# EAGLE design digitizerV2 (EAGLE 5.11)

## Sheet 1 of 4
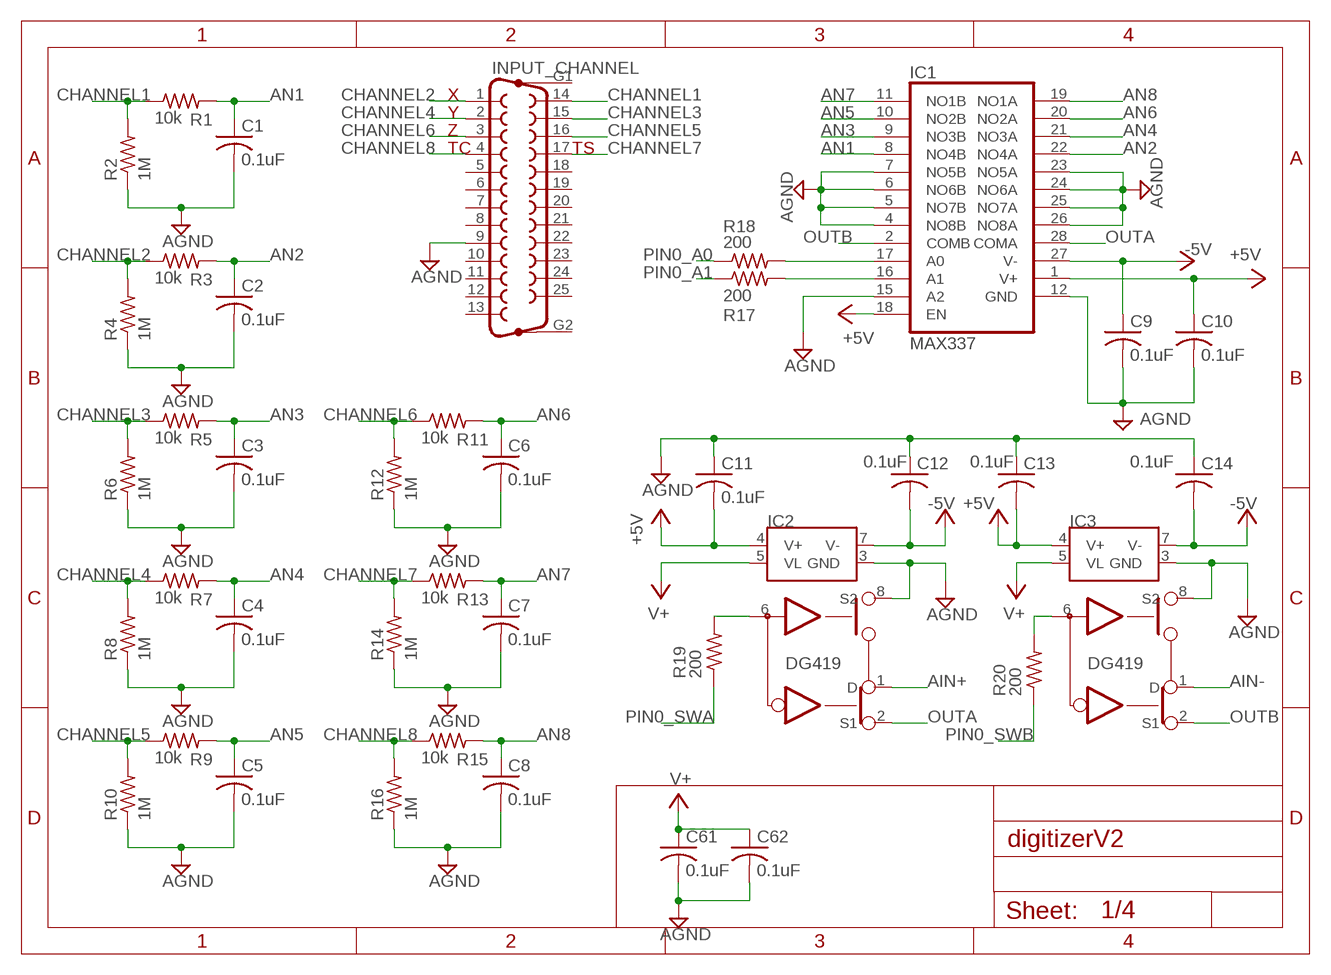
[diagram p0: schematic, sheet 1]

### Parts
C1  0.1uF  C-USC0603  [C0603]
C2  0.1uF  C-USC0603  [C0603]
C3  0.1uF  C-USC0603  [C0603]
C4  0.1uF  C-USC0603  [C0603]
C5  0.1uF  C-USC0603  [C0603]
C6  0.1uF  C-USC0603  [C0603]
C7  0.1uF  C-USC0603  [C0603]
C8  0.1uF  C-USC0603  [C0603]
C9  0.1uF  C-USC0603  [C0603]
C10  0.1uF  C-USC0603  [C0603]
C11  0.1uF  C-USC0603  [C0603]
C12  0.1uF  C-USC0603  [C0603]
C13  0.1uF  C-USC0603  [C0603]
C14  0.1uF  C-USC0603  [C0603]
C61  0.1uF  C-USC0603  [C0603]
C62  0.1uF  C-USC0603  [C0603]
IC1  MAX337  [SSOP28]
IC2  DG419  [SO08]
IC3  DG419  [SO08]
INPUT_CHANNEL  F25HP  [F25HP]
R1  10k  R-US_R0603  [R0603]
R2  1M  R-US_R0603  [R0603]
R3  10k  R-US_R0603  [R0603]
R4  1M  R-US_R0603  [R0603]
R5  10k  R-US_R0603  [R0603]
R6  1M  R-US_R0603  [R0603]
R7  10k  R-US_R0603  [R0603]
R8  1M  R-US_R0603  [R0603]
R9  10k  R-US_R0603  [R0603]
R10  1M  R-US_R0603  [R0603]
R11  10k  R-US_R0603  [R0603]
R12  1M  R-US_R0603  [R0603]
R13  10k  R-US_R0603  [R0603]
R14  1M  R-US_R0603  [R0603]
R15  10k  R-US_R0603  [R0603]
R16  1M  R-US_R0603  [R0603]
R17  200  R-US_R0603  [R0603]
R18  200  R-US_R0603  [R0603]
R19  200  R-US_R0603  [R0603]
R20  200  R-US_R0603  [R0603]

### Nets
+5V: C10.1 C11.2 C13.2 IC1.1(V+) IC1.18(EN) IC2.4(V+) IC3.4(V+) ; also sheet 2,3
-5V: C9.1 C12.2 C14.2 IC1.27(V-) IC2.7(V-) IC3.7(V-) ; also sheet 3
AGND: C1.2 C2.2 C3.2 C4.2 C5.2 C6.2 C7.2 C8.2 C9.2 C10.2 C11.1 C12.1 C13.1 C14.1 C61.2 C62.2 IC1.4(NO8B) IC1.5(NO7B) IC1.6(NO6B) IC1.7(NO5B) IC1.12(GND) IC1.15(A2) IC1.23(NO5A) IC1.24(NO6A) IC1.25(NO7A) IC1.26(NO8A) IC2.3(GND) IC2.8(S2) IC3.3(GND) IC3.8(S2) INPUT_CHANNEL.9 R2.1 R4.1 R6.1 R8.1 R10.1 R12.1 R14.1 R16.1 ; also sheet 2,3,4
AIN+: IC2.1(D) ; also sheet 2
AIN-: IC3.1(D) ; also sheet 2
AN1: C1.1 IC1.8(NO4B) R1.2
AN2: C2.1 IC1.22(NO4A) R3.2
AN3: C3.1 IC1.9(NO3B) R5.2
AN4: C4.1 IC1.21(NO3A) R7.2
AN5: C5.1 IC1.10(NO2B) R9.2
AN6: C6.1 IC1.20(NO2A) R11.2
AN7: C7.1 IC1.11(NO1B) R13.2
AN8: C8.1 IC1.19(NO1A) R15.2
CHANNEL1: INPUT_CHANNEL.14 R1.1 R2.2
CHANNEL2: INPUT_CHANNEL.1 R3.1 R4.2
CHANNEL3: INPUT_CHANNEL.15 R5.1 R6.2
CHANNEL4: INPUT_CHANNEL.2 R7.1 R8.2
CHANNEL5: INPUT_CHANNEL.16 R9.1 R10.2
CHANNEL6: INPUT_CHANNEL.3 R11.1 R12.2
CHANNEL7: INPUT_CHANNEL.17 R13.1 R14.2
CHANNEL8: INPUT_CHANNEL.4 R15.1 R16.2
N$1: IC2.6(IN) R19.2
N$2: IC3.6(IN) R20.2
N$3: IC1.17(A0) R18.2
N$4: IC1.16(A1) R17.2
OUTA: IC1.28(COMA) IC2.2(S1)
OUTB: IC1.2(COMB) IC3.2(S1)
PIN0_A0: R18.1 ; also sheet 4
PIN0_A1: R17.1 ; also sheet 4
PIN0_SWA: R19.1 ; also sheet 4
PIN0_SWB: R20.1 ; also sheet 4
V+: C61.1 C62.1 IC2.5(VL) IC3.5(VL) ; also sheet 2,3,4
Unconnected: INPUT_CHANNEL.5 INPUT_CHANNEL.6 INPUT_CHANNEL.7 INPUT_CHANNEL.8 INPUT_CHANNEL.10 INPUT_CHANNEL.11 INPUT_CHANNEL.12 INPUT_CHANNEL.13 INPUT_CHANNEL.18 INPUT_CHANNEL.19 INPUT_CHANNEL.20 INPUT_CHANNEL.21 INPUT_CHANNEL.22 INPUT_CHANNEL.23 INPUT_CHANNEL.24 INPUT_CHANNEL.25 INPUT_CHANNEL.G1 INPUT_CHANNEL.G2

### Notes on the sheet
- X
- Y
- Z
- TC | TS

## Sheet 2 of 4
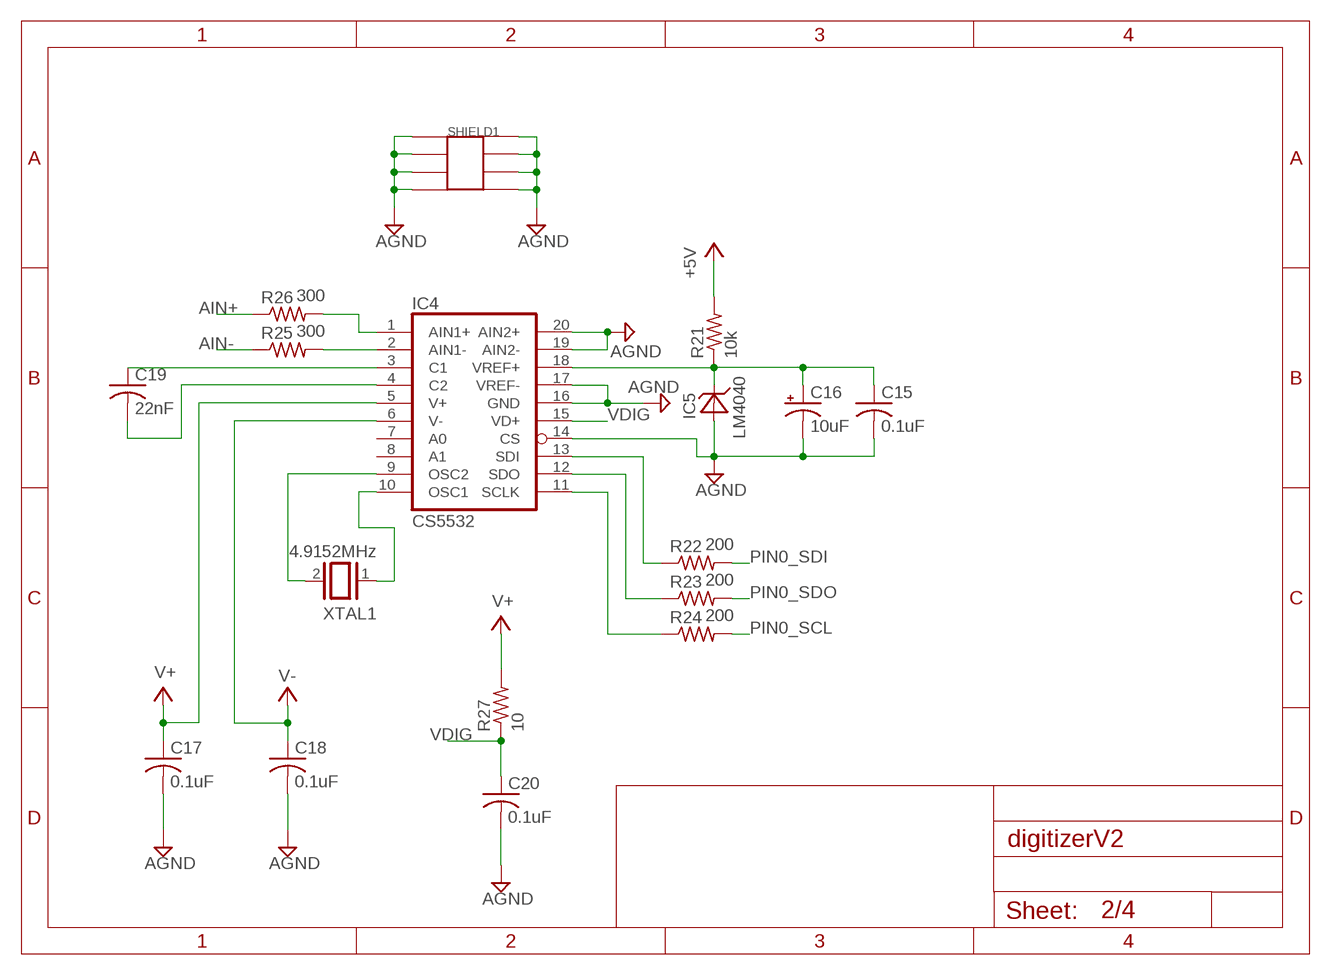
[diagram p1: schematic, sheet 2]

### Parts
C15  0.1uF  C-USC0603  [C0603]
C16  10uF  CPOL-USA/3216-18W  [A/3216-18W]
C17  0.1uF  C-USC0603  [C0603]
C18  0.1uF  C-USC0603  [C0603]
C19  22nF  C-USC0603  [C0603]
C20  0.1uF  C-USC0603  [C0603]
IC4  CS5532  [SSOP20]
IC5  LM4040  LM404  [SOT-23-3]
R21  10k  R-US_R0603  [R0603]
R22  200  R-US_R0603  [R0603]
R23  200  R-US_R0603  [R0603]
R24  200  R-US_R0603  [R0603]
R25  300  R-US_R0603  [R0603]
R26  300  R-US_R0603  [R0603]
R27  10  R-US_R0805  [R0805]
SHIELD1  SHIELD_50X38  [SHIELD_38X50]
XTAL1  4.9152MHz  CRYSTAL_SMD  [CRYSTAL_SMD]

### Nets
+5V: R21.2 ; also sheet 1,3
AGND: C15.2 C16.- C17.2 C18.2 C20.2 IC4.14(CS) IC4.16(GND) IC4.17(VREF-) IC4.19(AIN2-) IC4.20(AIN2+) IC5.2 SHIELD1.P$1 SHIELD1.P$2 SHIELD1.P$3 SHIELD1.P$4 SHIELD1.P$5 SHIELD1.P$6 SHIELD1.P$7 SHIELD1.P$8 ; also sheet 1,3,4
AIN+: R26.1 ; also sheet 1
AIN-: R25.1 ; also sheet 1
N$5: C15.1 C16.+ IC4.18(VREF+) IC5.1 R21.1
N$6: IC4.10(OSC1) XTAL1.1
N$7: IC4.13(SDI) R22.1
N$8: IC4.12(SDO) R23.1
N$9: IC4.11(SCLK) R24.1
N$10: IC4.9(OSC2) XTAL1.2
N$13: C19.1 IC4.3(C1)
N$14: C19.2 IC4.4(C2)
N$15: IC4.2(AIN1-) R25.2
N$16: IC4.1(AIN1+) R26.2
PIN0_SCL: R24.2 ; also sheet 4
PIN0_SDI: R22.2 ; also sheet 4
PIN0_SDO: R23.2 ; also sheet 4
V+: C17.1 IC4.5(V+) R27.2 ; also sheet 1,3,4
V-: C18.1 IC4.6(V-) ; also sheet 3
VDIG: C20.1 IC4.15(VD+) R27.1
Unconnected: IC4.7(A0) IC4.8(A1)

## Sheet 3 of 4
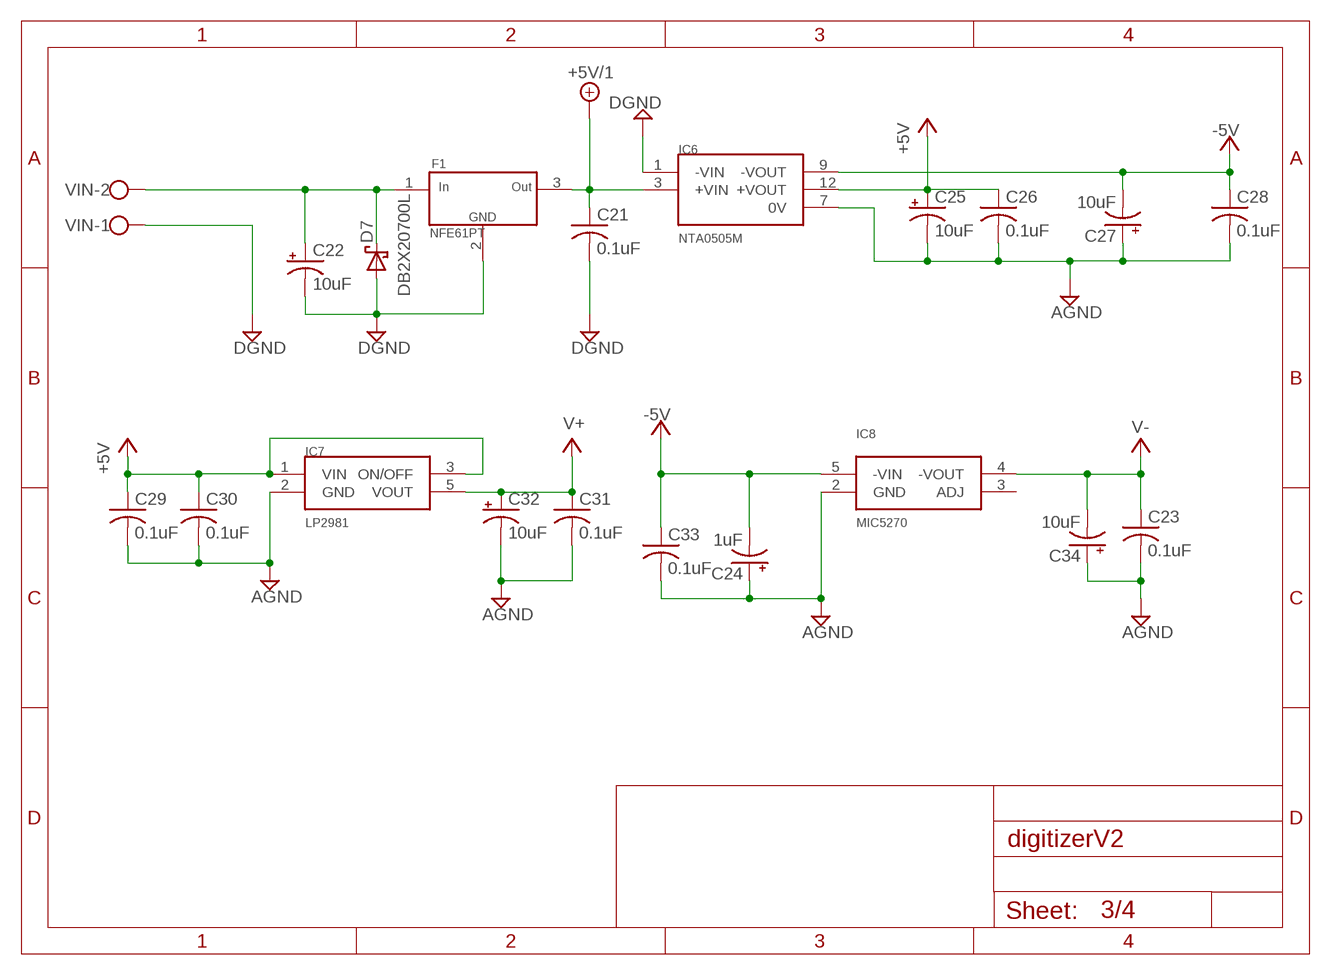
[diagram p2: schematic, sheet 3]

### Parts
C21  0.1uF  C-USC0603  [C0603]
C22  10uF  CPOL-USA/3216-18W  [A/3216-18W]
C23  0.1uF  C-USC0603  [C0603]
C24  1uF  CPOL-USB  [PANASONIC_B]
C25  10uF  CPOL-USA/3216-18W  [A/3216-18W]
C26  0.1uF  C-USC0603  [C0603]
C27  10uF  CPOL-USA/3216-18W  [A/3216-18W]
C28  0.1uF  C-USC0603  [C0603]
C29  0.1uF  C-USC0603  [C0603]
C30  0.1uF  C-USC0603  [C0603]
C31  0.1uF  C-USC0603  [C0603]
C32  10uF  CPOL-USA/3216-18W  [A/3216-18W]
C33  0.1uF  C-USC0603  [C0603]
C34  10uF  CPOL-USA/3216-18W  [A/3216-18W]
D7  DB2X20700L  SCHOTTKY_SMD  [DIODE_PW]
F1  NFE61PT  EMIFIL  [NFE-2706]
IC6  NTA0505M  [DCDC]
IC7  LP2981  [SOT-23-5]
IC8  MIC5270  [SOT-23-5]
VIN  W237-102  [W237-102]

### Nets
+5V: C25.+ C26.1 C29.1 C30.1 IC6.12(+VOUT) IC7.1(VIN) IC7.3(ON/OFF) ; also sheet 1,2
+5V/1: C21.1 F1.3 IC6.3(+VIN) ; also sheet 4
-5V: C24.- C27.- C28.1 C33.1 IC6.9(-VOUT) IC8.5(-VIN) ; also sheet 1
AGND: C23.2 C24.+ C25.- C26.2 C27.+ C28.2 C29.2 C30.2 C31.2 C32.- C33.2 C34.+ IC6.7(0V) IC7.2(GND) IC8.2(GND) ; also sheet 1,2,4
DGND: C21.2 C22.- D7.A F1.2 IC6.1(-VIN) VIN.1 ; also sheet 4
N$52: C22.+ D7.K(C) F1.1 VIN.2
V+: C31.1 C32.+ IC7.5(VOUT) ; also sheet 1,2,4
V-: C23.1 C34.- IC8.4(-VOUT) ; also sheet 2
Unconnected: IC8.3(ADJ)

## Sheet 4 of 4
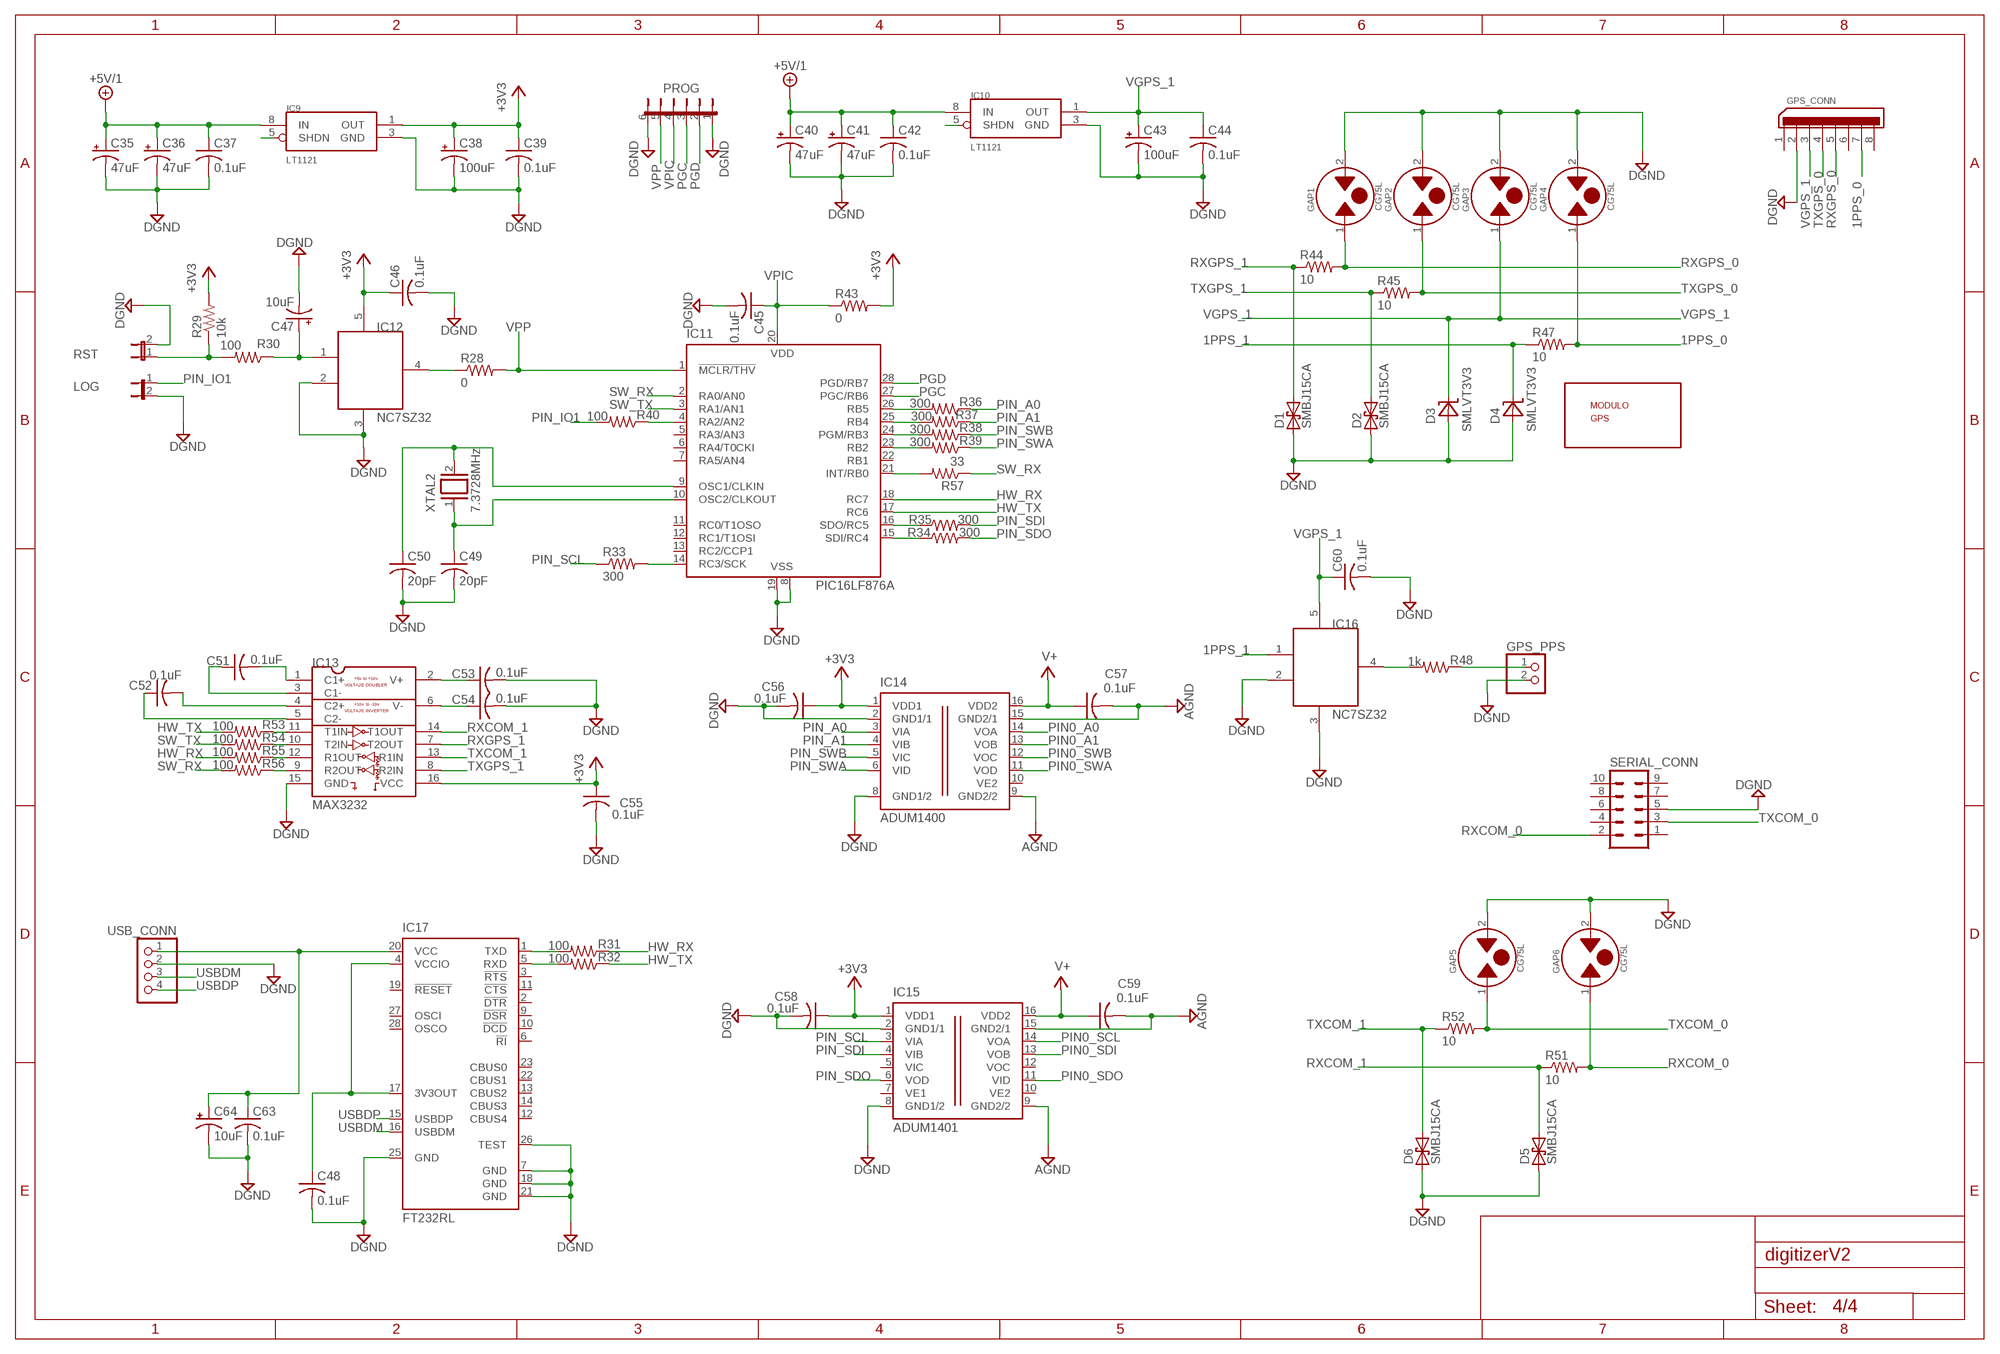
[diagram p3: schematic, sheet 4]

### Parts
C35  47uF  CPOL-USE  [PANASONIC_E]
C36  47uF  CPOL-USE  [PANASONIC_E]
C37  0.1uF  C-USC0603  [C0603]
C38  100uF  CPOL-USE  [PANASONIC_E]
C39  0.1uF  C-USC0603  [C0603]
C40  47uF  CPOL-USE  [PANASONIC_E]
C41  47uF  CPOL-USE  [PANASONIC_E]
C42  0.1uF  C-USC0603  [C0603]
C43  100uF  CPOL-USE  [PANASONIC_E]
C44  0.1uF  C-USC0603  [C0603]
C45  0.1uF  C-USC0603  [C0603]
C46  0.1uF  C-USC0603  [C0603]
C47  10uF  CPOL-USA/3216-18W  [A/3216-18W]
C48  0.1uF  C-USC0603  [C0603]
C49  20pF  C-USC0603  [C0603]
C50  20pF  C-USC0603  [C0603]
C51  0.1uF  C-USC0603  [C0603]
C52  0.1uF  C-USC0603  [C0603]
C53  0.1uF  C-USC0603  [C0603]
C54  0.1uF  C-USC0603  [C0603]
C55  0.1uF  C-USC0603  [C0603]
C56  0.1uF  C-USC0603  [C0603]
C57  0.1uF  C-USC0603  [C0603]
C58  0.1uF  C-USC0603  [C0603]
C59  0.1uF  C-USC0603  [C0603]
C60  0.1uF  C-USC0603  [C0603]
C63  0.1uF  C-USC0603  [C0603]
C64  10uF  CPOL-USA/3216-18W  [A/3216-18W]
D1  SMBJ15CA  MSBJ15CA  [DIODE_KK2]
D2  SMBJ15CA  MSBJ15CA  [DIODE_KK2]
D3  SMLVT3V3  SMBJ5.0A  [DIODE_KK]
D4  SMLVT3V3  SMBJ5.0A  [DIODE_KK]
D5  SMBJ15CA  MSBJ15CA  [DIODE_KK2]
D6  SMBJ15CA  MSBJ15CA  [DIODE_KK2]
GAP1  CG75L  [GAP]
GAP2  CG75L  [GAP]
GAP3  CG75L  [GAP]
GAP4  CG75L  [GAP]
GAP5  CG75L  [GAP]
GAP6  CG75L  [GAP]
GPS_CONN  MOLEX_FLEX8  [MOLEX_FLEX8PIN]
GPS_PPS  PINHD-1X2  [1X02]
IC9  LT1121  LT1121-3.3  [SO08]
IC10  LT1121  LT1121-3.3  [SO08]
IC11  PIC16LF876A  PIC16F876SO  [SO28W]
IC12  NC7SZ32  NC7S32  [SOT-23-5]
IC13  MAX3232  [SOIC16N]
IC14  ADUM1400  [SO-16W]
IC15  ADUM1401  [SO-16W]
IC16  NC7SZ32  NC7S32  [SOT-23-5]
IC17  FT232RL  [SSOP28]
LOG  HEADER_SMD_2  [HEADER_SMD_2]
MODGPS1  GPS15LF  [GPS15LF]
PROG  HEADER_SMD_6  [HEADER_SMD_6]
R28  0  R-US_R0603  [R0603]
R29  10k  R-US_R0603  [R0603]
R30  100  R-US_R0603  [R0603]
R31  100  R-US_R0603  [R0603]
R32  100  R-US_R0603  [R0603]
R33  300  R-US_R0603  [R0603]
R34  300  R-US_R0603  [R0603]
R35  300  R-US_R0603  [R0603]
R36  300  R-US_R0603  [R0603]
R37  300  R-US_R0603  [R0603]
R38  300  R-US_R0603  [R0603]
R39  300  R-US_R0603  [R0603]
R40  100  R-US_R0603  [R0603]
R43  0  R-US_R0603  [R0603]
R44  10  R-US_R0805  [R0805]
R45  10  R-US_R0805  [R0805]
R47  10  R-US_R0805  [R0805]
R48  1k  R-US_R0603  [R0603]
R51  10  R-US_R0805  [R0805]
R52  10  R-US_R0805  [R0805]
R53  100  R-US_R0603  [R0603]
R54  100  R-US_R0603  [R0603]
R55  100  R-US_R0603  [R0603]
R56  100  R-US_R0603  [R0603]
R57  33  R-US_R0603  [R0603]
RST  HEADER_SMD_2  [HEADER_SMD_2]
SERIAL_CONN  ML10  [ML10]
USB_CONN  PINHD-1X4  [1X04]
XTAL2  7.3728MHz  CRYSTAL_SMD  [CRYSTAL_SMD]

### Nets
1PPS_0: GAP4.1 GPS_CONN.7 R47.2
1PPS_1: D4.A1(C) IC16.1(IN1) R47.1
+3V3: C38.+ C39.1 C46.1 C55.1 C56.1 C58.1 IC9.1(OUT) IC12.5(1_VCC) IC13.16(VCC) IC14.1(VDD1) IC15.1(VDD1) R29.2 R43.2
+5V/1: C35.+ C36.+ C37.1 C40.+ C41.+ C42.1 IC9.8(IN) IC10.8(IN) ; also sheet 3
AGND: C57.2 C59.2 IC14.9(GND2/2) IC14.15(GND2/1) IC15.9(GND2/2) IC15.15(GND2/1) ; also sheet 1,2,3
DGND: C35.- C36.- C37.2 C38.- C39.2 C40.- C41.- C42.2 C43.- C44.2 C45.2 C46.2 C47.- C48.2 C49.2 C50.2 C53.2 C54.2 C55.2 C56.2 C58.2 C60.2 C63.2 C64.- D1.A1 D2.A1 D3.A2(A) D4.A2(A) D5.A1 D6.A1 GAP1.2 GAP2.2 GAP3.2 GAP4.2 GAP5.2 GAP6.2 GPS_CONN.2 GPS_PPS.2 IC9.3(GND) IC10.3(GND) IC11.8(VSS) IC11.19(VSS) IC12.2(IN2) IC12.3(1_GND) IC13.15(GND) IC14.2(GND1/1) IC14.8(GND1/2) IC15.2(GND1/1) IC15.8(GND1/2) IC16.2(IN2) IC16.3(1_GND) IC17.7(GND) IC17.18(GND) IC17.21(GND) IC17.25(GND) IC17.26(TEST) LOG.2 PROG.1 PROG.6 RST.2 SERIAL_CONN.5 USB_CONN.2 ; also sheet 3
HW_RX: IC11.18(RC7) R31.1 R55.2
HW_TX: IC11.17(RC6) R32.1 R53.2
N$11: C52.2 IC13.4(C2+)
N$12: R29.1 R30.2 RST.1
N$17: IC12.4(OUT) R28.1
N$19: C49.1 IC11.10(OSC2/CLKOUT) XTAL2.1
N$20: C47.+ IC12.1(IN1) R30.1
N$21: C48.1 IC17.4(VCCIO) IC17.17(3V3OUT)
N$22: C50.1 IC11.9(OSC1/CLKIN) XTAL2.2
N$23: IC17.1(TXD) R31.2
N$24: IC11.16(SDO/RC5) R35.1
N$25: IC11.15(SDI/RC4) R34.1
N$26: IC11.14(RC3/SCK) R33.2
N$27: IC11.26(RB5) R36.2
N$28: IC11.25(RB4) R37.2
N$29: IC11.24(PGM/RB3) R38.2
N$30: IC11.23(RB2) R39.2
N$31: IC11.4(RA2/AN2) R40.1
N$32: IC17.5(RXD) R32.2
N$33: C63.1 C64.+ IC17.20(VCC) USB_CONN.1
N$34: C51.2 IC13.1(C1+)
N$35: C51.1 IC13.3(C1-)
N$36: C52.1 IC13.5(C2-)
N$37: IC13.11(T1IN) R53.1
N$38: C53.1 IC13.2(V+)
N$39: C54.1 IC13.6(V-)
N$40: IC16.4(OUT) R48.2
N$41: GPS_PPS.1 R48.1
N$42: IC13.10(T2IN) R54.1
N$44: IC13.12(R1OUT) R55.1
N$45: IC13.9(R2OUT) R56.1
N$46: IC11.21(INT/RB0) R57.2
N$47: IC10.5(SHDN)
N$48: IC9.5(SHDN)
PGC: IC11.27(PGC/RB6) PROG.3
PGD: IC11.28(PGD/RB7) PROG.2
PIN0_A0: IC14.14(VOA) ; also sheet 1
PIN0_A1: IC14.13(VOB) ; also sheet 1
PIN0_SCL: IC15.14(VOA) ; also sheet 2
PIN0_SDI: IC15.13(VOB) ; also sheet 2
PIN0_SDO: IC15.11(VID) ; also sheet 2
PIN0_SWA: IC14.11(VOD) ; also sheet 1
PIN0_SWB: IC14.12(VOC) ; also sheet 1
PIN_A0: IC14.3(VIA) R36.1
PIN_A1: IC14.4(VIB) R37.1
PIN_IO1: LOG.1 R40.2
PIN_SCL: IC15.3(VIA) R33.1
PIN_SDI: IC15.4(VIB) R35.2
PIN_SDO: IC15.6(VOD) R34.2
PIN_SWA: IC14.6(VID) R39.1
PIN_SWB: IC14.5(VIC) R38.1
RXCOM_0: GAP6.1 R51.2 SERIAL_CONN.2
RXCOM_1: D5.A2 IC13.14(T1OUT) R51.1
RXGPS_0: GAP1.1 GPS_CONN.5 R44.2
RXGPS_1: D1.A2 IC13.7(T2OUT) R44.1
SW_RX: IC11.2(RA0/AN0) R56.2 R57.1
SW_TX: IC11.3(RA1/AN1) R54.2
TXCOM_0: GAP5.1 R52.2 SERIAL_CONN.3
TXCOM_1: D6.A2 IC13.13(R1IN) R52.1
TXGPS_0: GAP2.1 GPS_CONN.4 R45.2
TXGPS_1: D2.A2 IC13.8(R2IN) R45.1
USBDM: IC17.16(USBDM) USB_CONN.3
USBDP: IC17.15(USBDP) USB_CONN.4
V+: C57.1 C59.1 IC14.16(VDD2) IC15.16(VDD2) ; also sheet 1,2,3
VGPS_1: C43.+ C44.1 C60.1 D3.A1(C) GAP3.1 GPS_CONN.3 IC10.1(OUT) IC16.5(1_VCC)
VPIC: C45.1 IC11.20(VDD) PROG.4 R43.1
VPP: IC11.1(!MCLR/THV) PROG.5 R28.2
Unconnected: GPS_CONN.1 GPS_CONN.6 GPS_CONN.8 IC11.5(RA3/AN3) IC11.6(RA4/T0CKI) IC11.7(RA5/AN4) IC11.11(RC0/T1OSO) IC11.12(RC1/T1OSI) IC11.13(RC2/CCP1) IC11.22(RB1) IC14.10(VE2) IC15.5(VIC) IC15.7(VE1) IC15.10(VE2) IC15.12(VOC) IC17.2(!DTR) IC17.3(!RTS) IC17.6(!RI) IC17.9(!DSR) IC17.10(!DCD) IC17.11(!CTS) IC17.12(CBUS4) IC17.13(CBUS2) IC17.14(CBUS3) IC17.19(!RESET) IC17.22(CBUS1) IC17.23(CBUS0) IC17.27(OSCI) IC17.28(OSCO) SERIAL_CONN.1 SERIAL_CONN.4 SERIAL_CONN.6 SERIAL_CONN.7 SERIAL_CONN.8 SERIAL_CONN.9 SERIAL_CONN.10

## Library data of the parts
C1-C15 C17-C21 C23 C26 C28-C31 C33 C37 C39 C42 C44-C46 C48-C63 = rcl:C-US: CAPACITOR, American symbol
C16 C22 C24 C25 C27 C32 C34-C36 C38 C40 C41 C43 C47 C64 = rcl:CPOL-US: POLARIZED CAPACITOR, American symbol
D1 D2 D5 D6 = magnetometro:MSBJ15CA
D3 D4 = magnetometro:SMBJ5.0A
D7 = magnetometro:SCHOTTKY_SMD
F1 = magnetometro:EMIFIL
GAP1-GAP6 = magnetometro:CG75L
GPS_CONN = magnetometro:MOLEX_FLEX8
GPS_PPS = pinhead:PINHD-1X2: PIN HEADER
IC1 = Ricardo_Library:MAX337
IC2 IC3 = Ricardo_Library:DG419
IC4 = Ricardo_Library:CS5532
IC5 = Ricardo_Library:LM404
IC6 = Ricardo_Library:NTA0505M
IC7 = Ricardo_Library:LP2981
IC8 = Ricardo_Library:MIC5270
IC9 IC10 = Ricardo_Library:LT1121-3.3
IC11 = Ricardo_Library:PIC16F876SO
IC12 IC16 = magnetometro:NC7S32
IC13 = Ricardo_Library:MAX3232
IC14 = Ricardo_Library:ADUM1400
IC15 = Ricardo_Library:ADUM1401
IC17 = ftdichip:FT232R: Source: http://www.ftdichip.com/Documents/DataSheets/DS_FT232R_v104.pdf; MPN: FT232RL; OC_FARNELL: 1146032; OC_NEWARK: 91K9918
INPUT_CHANNEL = con-subd:F25HP: SUB-D; OC_FARNELL: unknown; OC_NEWARK: unknown
LOG RST = Ricardo_Library:HEADER_SMD_2
MODGPS1 = magnetometro:GPS15LF
PROG = Ricardo_Library:HEADER_SMD_6
R1-R40 R43-R45 R47 R48 R51-R57 = rcl:R-US_: RESISTOR, American symbol
SERIAL_CONN = con-harting-ml:ML10: HARTING; OC_FARNELL: unknown; OC_NEWARK: unknown
SHIELD1 = magnetometro:SHIELD_50X38
USB_CONN = pinhead:PINHD-1X4: PIN HEADER
VIN = con-wago-500:W237-102: WAGO SCREW CLAMP; MPN: 237-102; OC_FARNELL: unknown; OC_NEWARK: 70K9898
XTAL1 XTAL2 = Ricardo_Library:CRYSTAL_SMD

## Board
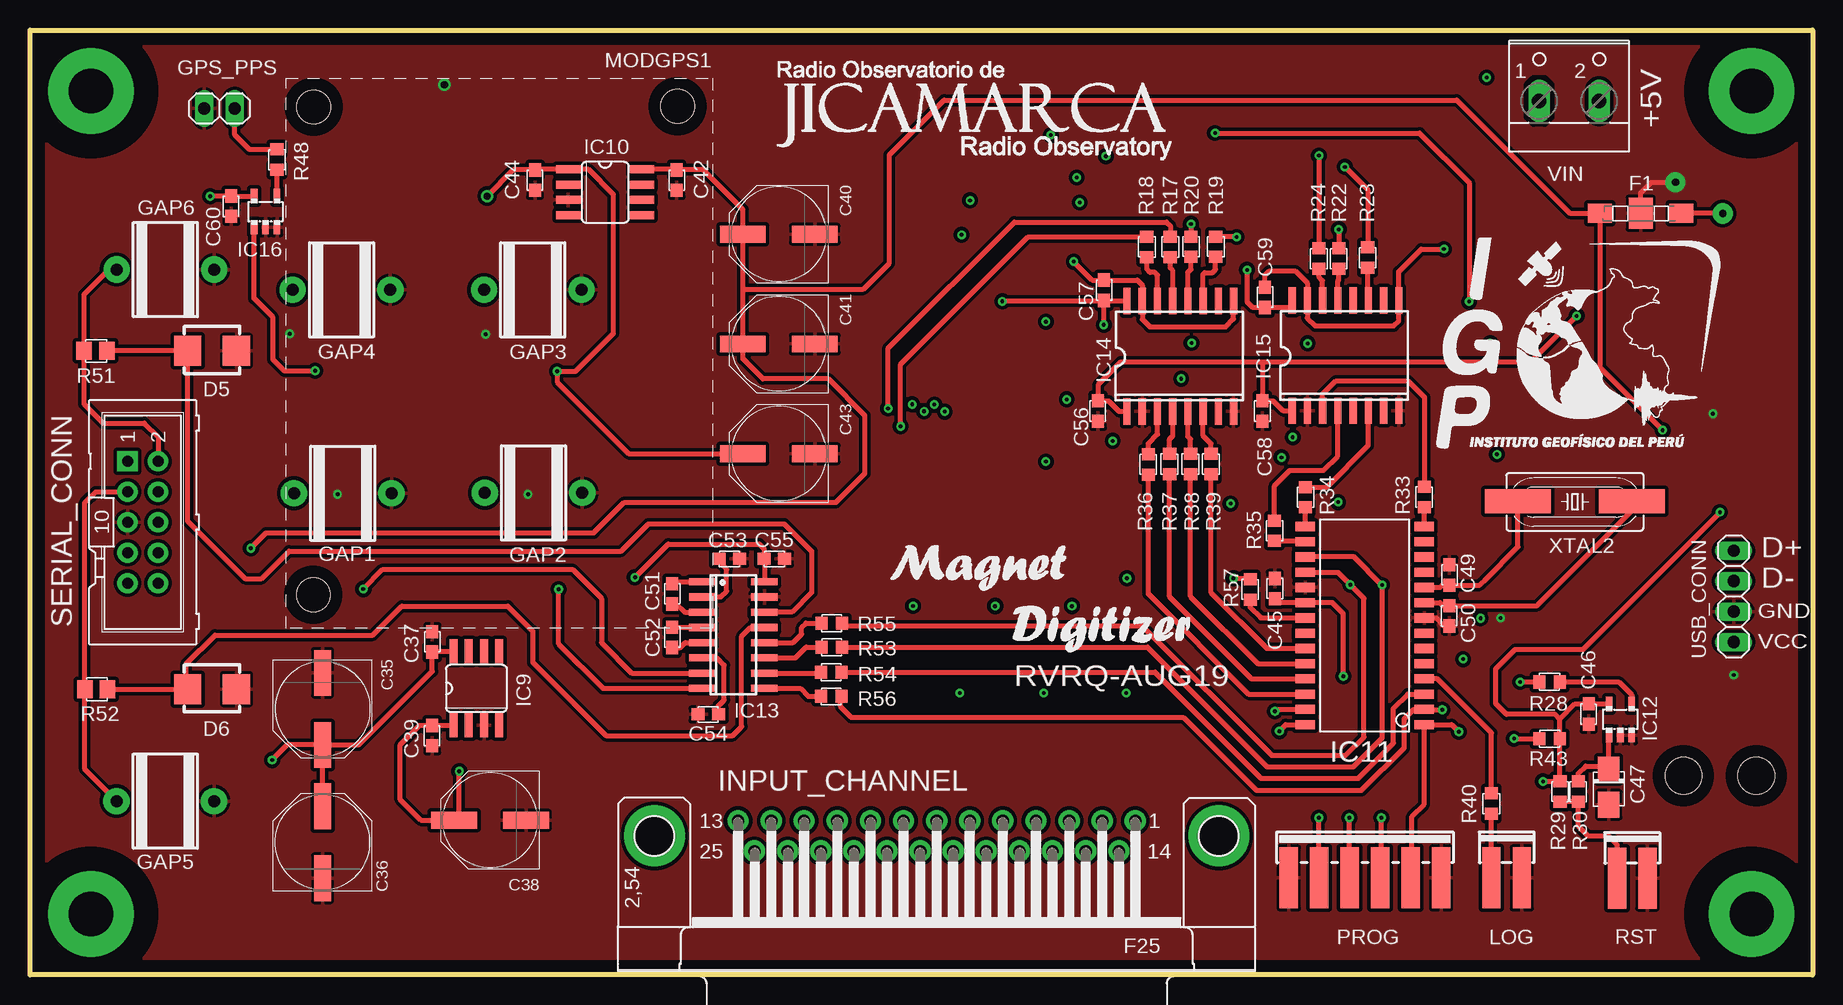
[diagram p4: board, top side]
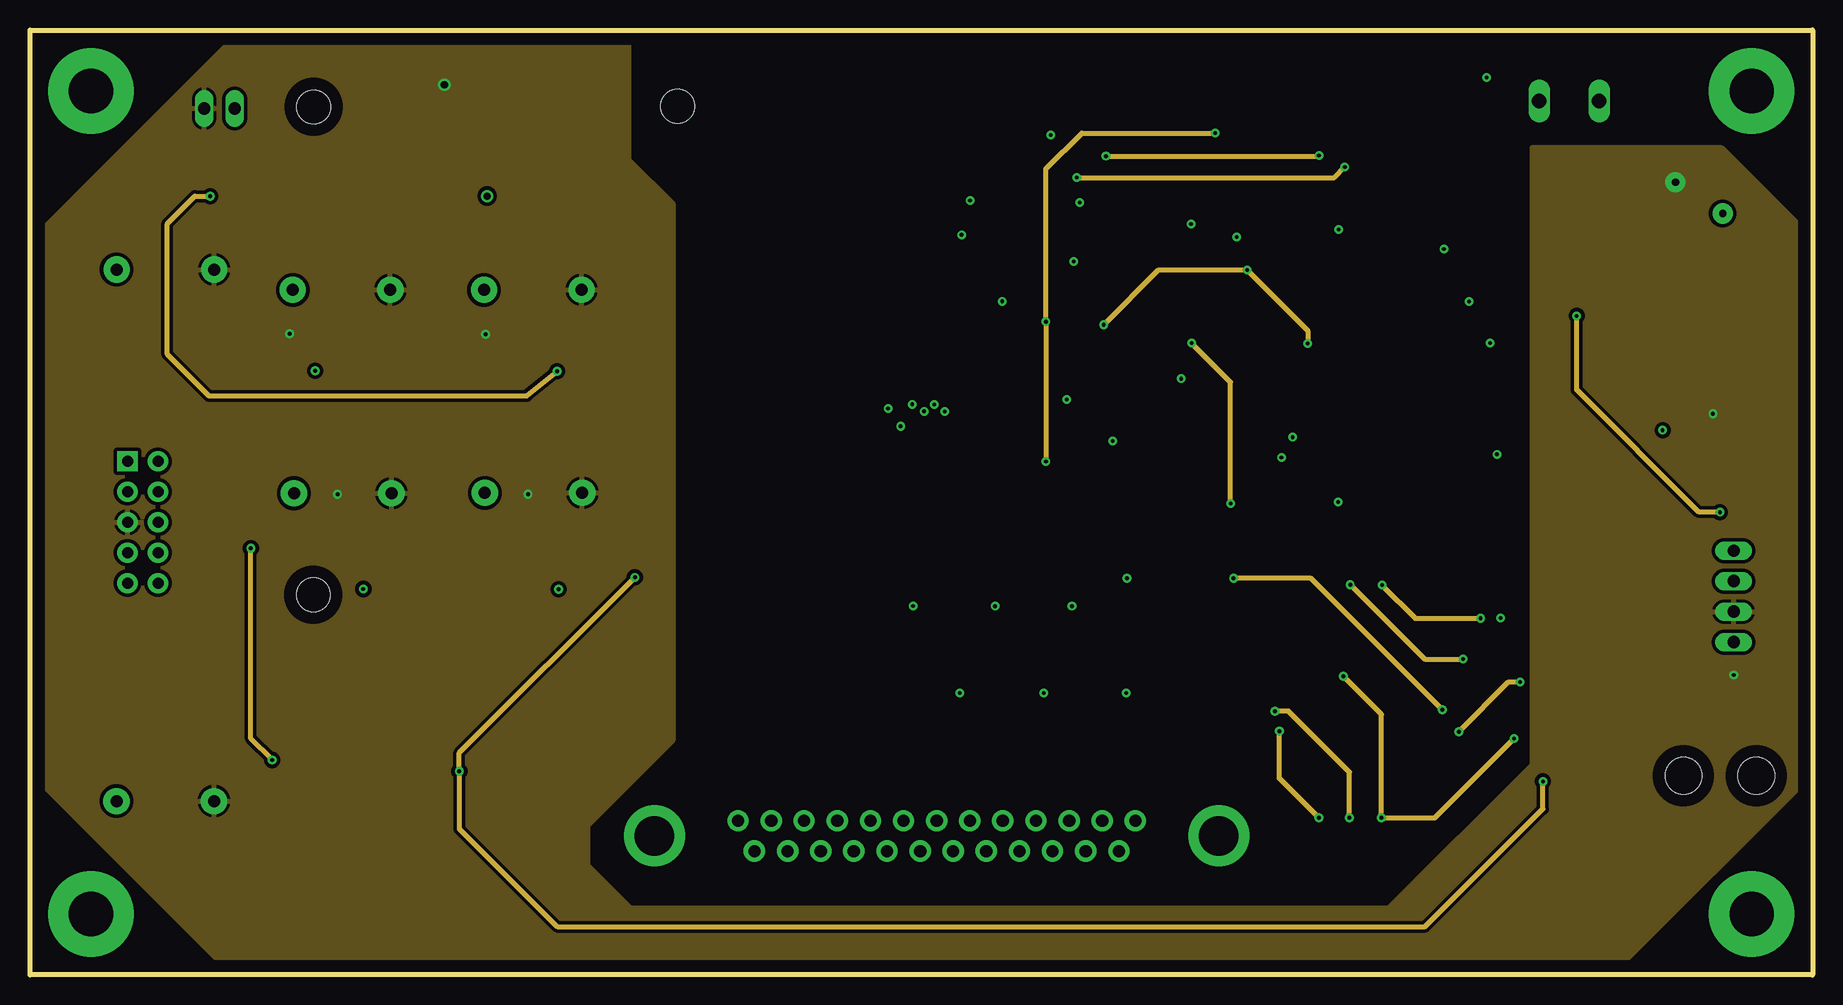
[diagram p5: board, inner layer Route2]
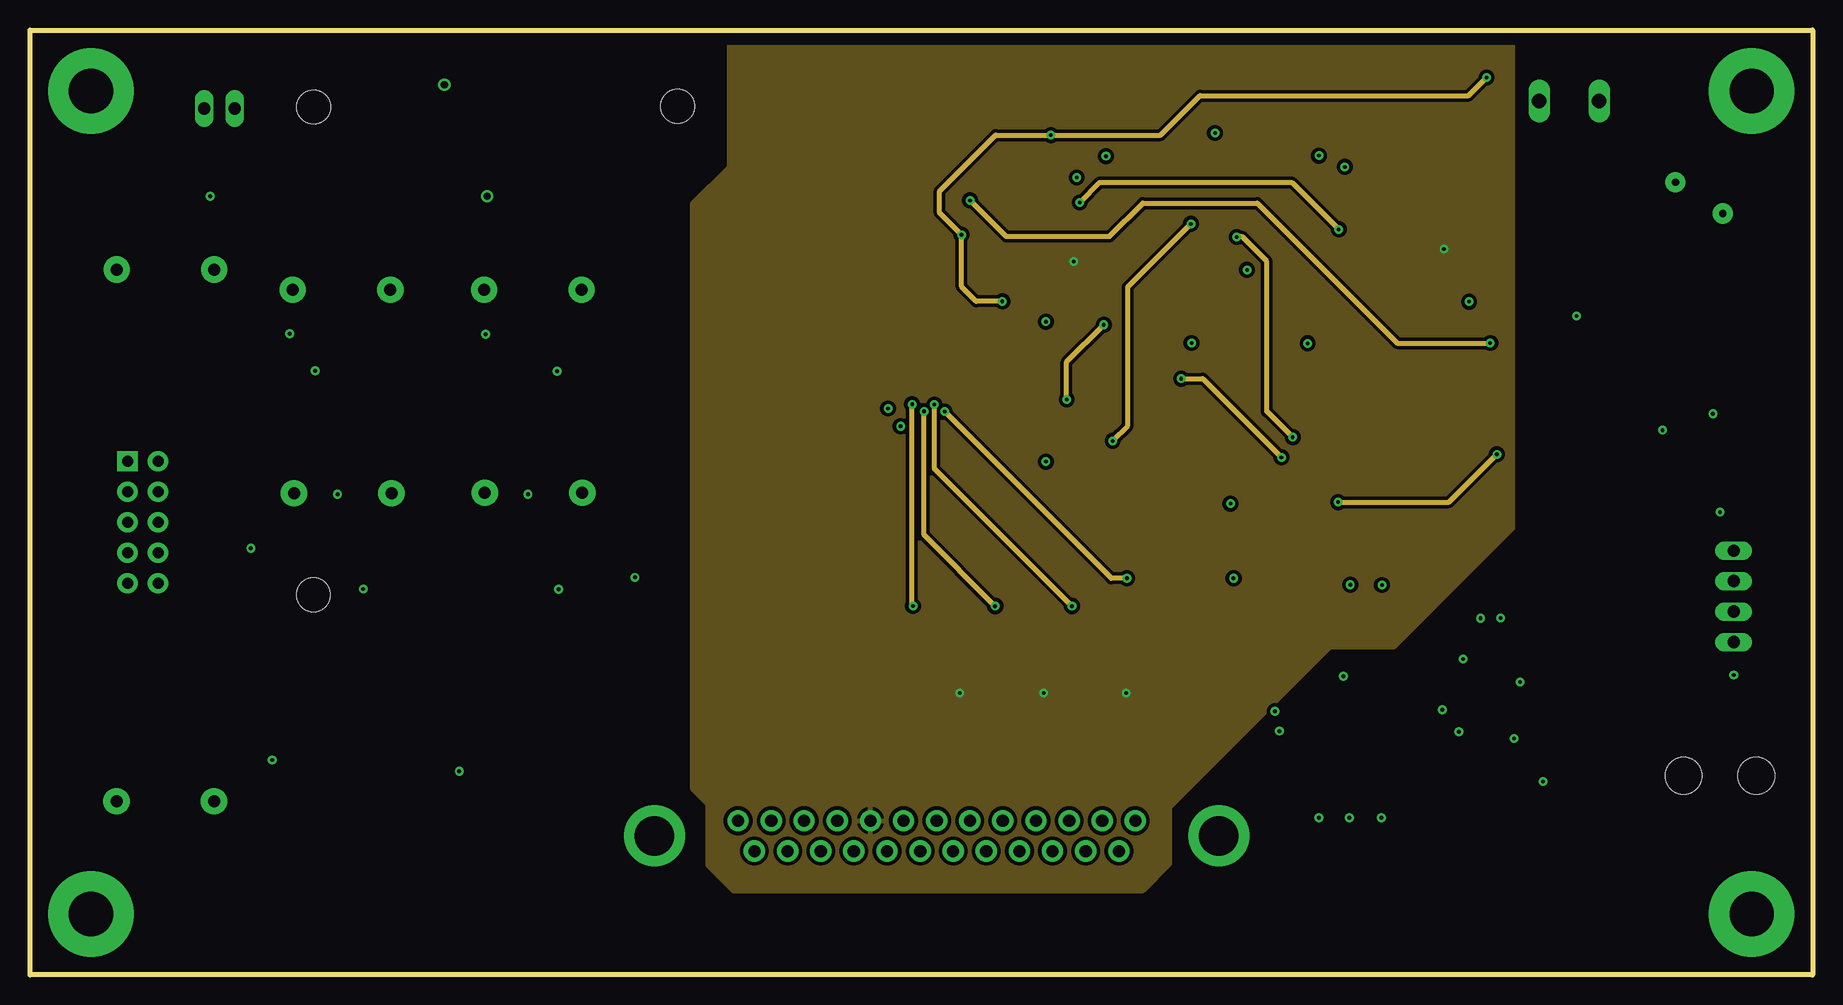
[diagram p6: board, inner layer Route15]
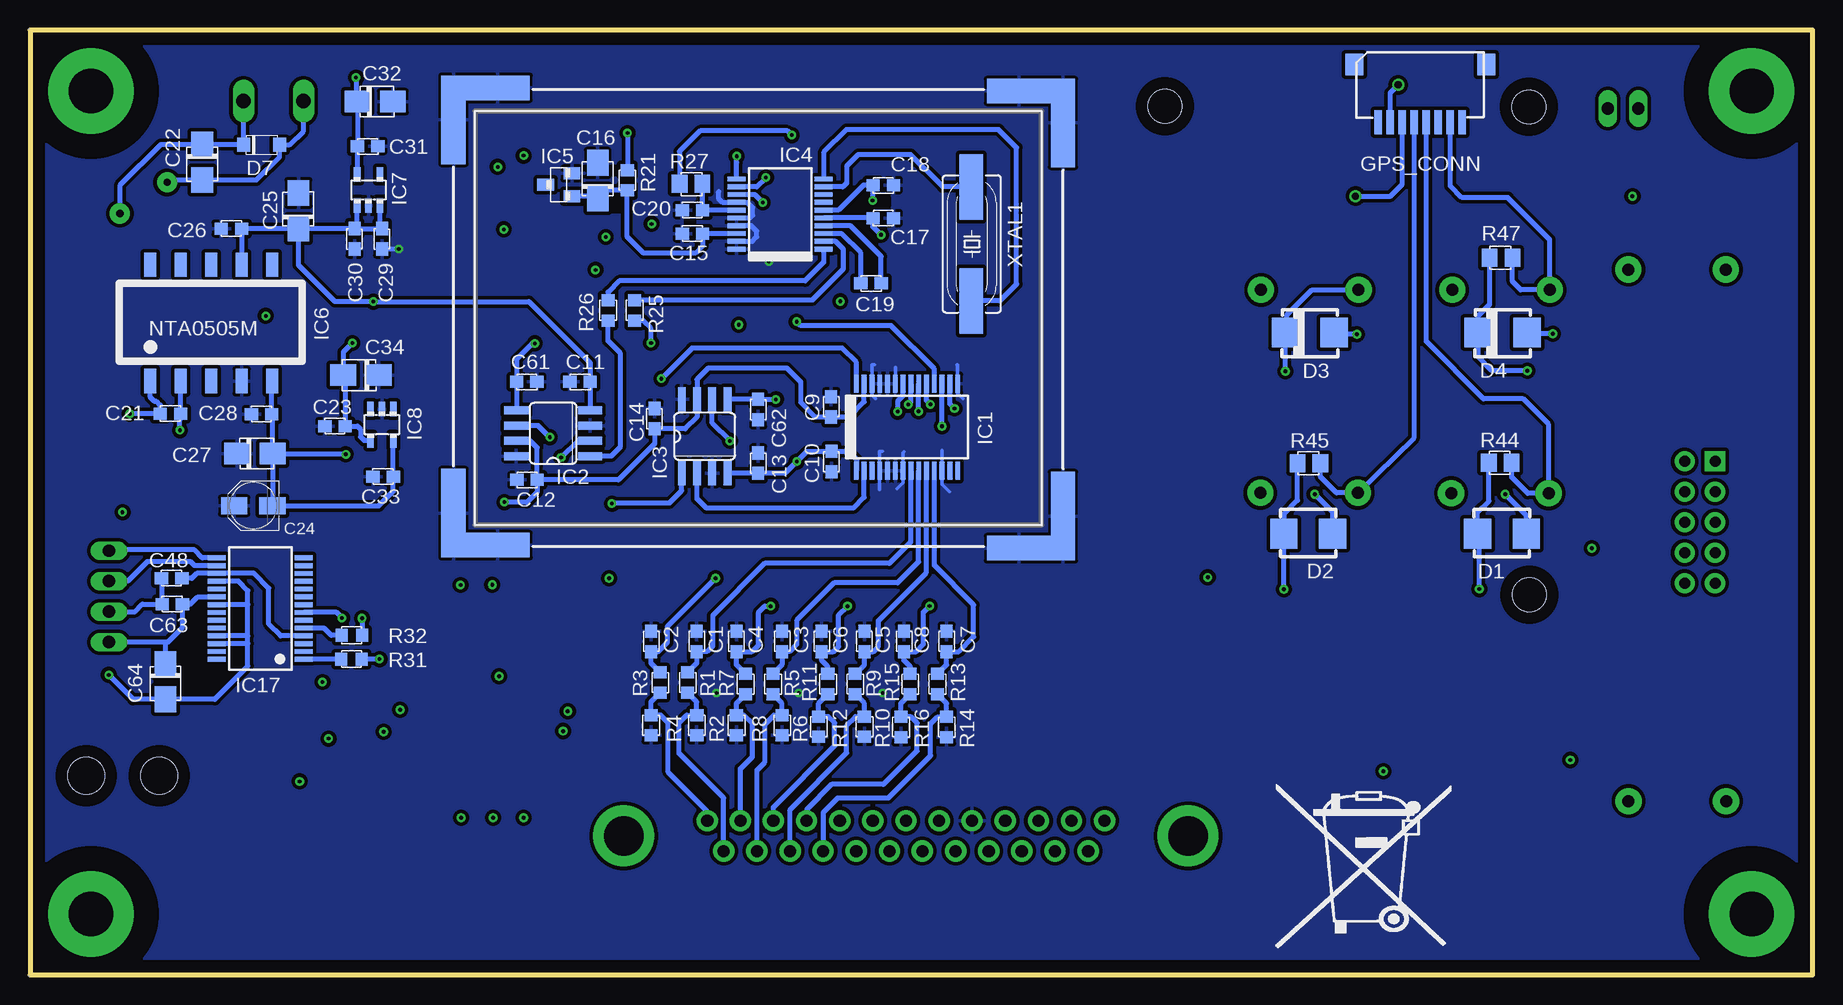
[diagram p7: board, bottom side, seen from below]

Size 148.59 x 78.74 mm. Coordinates in mm from the lower left corner, seen from the top.
Outline: 0,78.74 148.59,78.74 148.59,0 0,0 0,78.74
Copper layers (1+2*15+16): Top 0.035mm / dielectric 1.5mm / Route2 0.035mm / dielectric 0.15mm / Route15 0.035mm / dielectric 0.2mm / Bottom 0.035mm
Design rules "default *": minimum track width 10mil, minimum drill 24mil, track to track 8mil, track to pad 8mil, pad to pad 8mil, via to via 8mil, smd to smd 8mil, copper to edge 40mil, drill to drill 8mil, minimum pad ring 10mil, minimum via ring 8mil, stop-mask expansion 4mil, vias tented up to drill 0mil, thermal gap 10mil
Holes 3.05 mm at 137.83,16.6 143.9,16.6
tRestrict: area 0,68.6 to 10.2,78.8; area 0,0 to 10.2,10.2; area 138.4,0 to 148.6,10.2; area 138.4,68.6 to 148.6,78.8; area 124.8,71 to 126.7,74.7
bRestrict: area -0.1,68.5 to 10.2,78.8; area -0.1,-0.1 to 10.2,10.2; area 138.4,-0.1 to 148.6,10.2; area 138.4,68.5 to 148.6,78.8; 5 lines

### Footprints (pad centres in the part's own frame; a part is rotated, then mirrored left to right if it is on the bottom)
C0603 = smd 1.1 x 1: 1 -0.85,0; 2 0.85,0
A/3216-18W = smd 2.15 x 1.8: + 1.475,0; - -1.475,0
PANASONIC_B = smd 2.2 x 1.4: + 1.6,0; - -1.6,0
PANASONIC_E = smd 3.8 x 1.4: + 3,0; - -3,0
DIODE_KK2 = smd 2.286 x 2.489: A1 -2.286,-0.508; A2 1.778,-0.508
DIODE_KK = smd 2.286 x 2.489: A1 0.254,2.032; A2 4.318,2.032
DIODE_PW = smd 1.1 x 1.1: A 0,-1.5; K 0,1.5
NFE-2706 = smd 2 x 1.6: 1 -3.4,0; 3 3.4,0 | smd 2 x 2.6: 2 0,0
GAP = drill 1 pad 2.184 round: 1 -4.064,0; 2 4.064,0
MOLEX_FLEX8PIN = smd 0.6 x 2: 1 -3.19,-2.54; 2 -2.19,-2.54; 3 -1.19,-2.54; 4 -0.19,-2.54; 5 0.81,-2.54; 6 1.81,-2.54; 7 2.81,-2.54; 8 3.81,-2.54 | smd 1.5 x 1.8: NC1 -5.19,2.26; NC2 5.835,2.258
1X02 = drill 1.016 long: 1 -1.27,0; 2 1.27,0
SSOP28 = smd 0.4 x 1.5: 1 -4.225,-3.625; 2 -3.575,-3.625; 3 -2.925,-3.625; 4 -2.275,-3.625; 5 -1.625,-3.625; 6 -0.975,-3.625; 7 -0.325,-3.625; 8 0.325,-3.625; 9 0.975,-3.625; 10 1.625,-3.625; 11 2.275,-3.625; 12 2.925,-3.625; 13 3.575,-3.625; 14 4.225,-3.625; 15 4.225,3.625; 16 3.575,3.625; 17 2.925,3.625; 18 2.275,3.625; 19 1.625,3.625; 20 0.975,3.625; 21 0.325,3.625; 22 -0.325,3.625; 23 -0.975,3.625; 24 -1.625,3.625; 25 -2.275,3.625; 26 -2.925,3.625; 27 -3.575,3.625; 28 -4.225,3.625
SO08 = smd 0.66 x 2.032: 1 -1.905,-3.073; 2 -0.635,-3.073; 3 0.635,-3.073; 4 1.905,-3.073; 5 1.905,3.073; 6 0.635,3.073; 7 -0.635,3.073; 8 -1.905,3.073
SSOP20 = smd 0.4 x 1.5: 1 -2.925,-3.625; 2 -2.275,-3.625; 3 -1.625,-3.625; 4 -0.975,-3.625; 5 -0.325,-3.625; 6 0.325,-3.625; 7 0.975,-3.625; 8 1.625,-3.625; 9 2.275,-3.625; 10 2.925,-3.625; 11 2.925,3.625; 12 2.275,3.625; 13 1.625,3.625; 14 0.975,3.625; 15 0.325,3.625; 16 -0.325,3.625; 17 -0.975,3.625; 18 -1.625,3.625; 19 -2.275,3.625; 20 -2.925,3.625
SOT-23-3 = smd 1 x 1.4: 1 -0.95,-1.049; 2 0.95,-1.049; 3 0,1.151
DCDC = smd 1.016 x 2.032: 1 0,-9.703; 3 2.54,-9.703; 5 5.08,-9.703; 7 7.62,-9.703; 9 10.16,-9.703; 10 10.16,0; 12 7.62,0; 14 5.08,0; 16 2.54,0; 18 0,0
SOT-23-5 = smd 0.55 x 1.2: 1 -0.95,-1.3; 2 0,-1.3; 3 0.95,-1.3; 4 0.95,1.3; 5 -0.95,1.3
SO28W = smd 0.762 x 1.651: 1 -7.62,-4.958; 2 -6.35,-4.958; 3 -5.08,-4.958; 4 -3.81,-4.958; 5 -2.54,-4.958; 6 -1.27,-4.958; 7 0,-4.958; 8 1.27,-4.958; 9 2.54,-4.958; 10 3.81,-4.958; 11 5.08,-4.958; 12 6.35,-4.958; 13 7.62,-4.958; 14 8.89,-4.958; 15 8.89,4.958; 16 7.62,4.958; 17 6.35,4.958; 18 5.08,4.958; 19 3.81,4.958; 20 2.54,4.958; 21 1.27,4.958; 22 0,4.958; 23 -1.27,4.958; 24 -2.54,4.958; 25 -3.81,4.958; 26 -5.08,4.958; 27 -6.35,4.958; 28 -7.62,4.958
SOT-23-5' = smd 1.2 x 0.55: 1 1.3,-0.95; 2 1.3,0; 3 1.3,0.95; 4 -1.3,0.95; 5 -1.3,-0.95
SOIC16N = smd 0.6 x 2.2: 1 -3.302,-3.032; 2 -2.032,-3.032; 3 -0.762,-3.032; 4 0.508,-3.032; 5 1.778,-3.032; 6 3.048,-3.032; 7 4.318,-3.032; 8 5.588,-3.032; 9 5.588,2.168; 10 4.318,2.168; 11 3.048,2.168; 12 1.778,2.168; 13 0.508,2.168; 14 -0.762,2.168; 15 -2.032,2.168; 16 -3.302,2.168
SO-16W = smd 0.6 x 2.2: 1 -4.445,-4.6; 2 -3.175,-4.6; 3 -1.905,-4.6; 4 -0.635,-4.6; 5 0.635,-4.6; 6 1.905,-4.6; 7 3.175,-4.6; 8 4.445,-4.6; 9 4.445,4.6; 10 3.175,4.6; 11 1.905,4.6; 12 0.635,4.6; 13 -0.635,4.6; 14 -1.905,4.6; 15 -3.175,4.6; 16 -4.445,4.6
F25HP = drill 1.016 pad 1.778 round: 1 -16.561,-1.27; 2 -13.792,-1.27; 3 -11.049,-1.27; 4 -8.28,-1.27; 5 -5.512,-1.27; 6 -2.769,-1.27; 7 0,-1.27; 8 2.769,-1.27; 9 5.512,-1.27; 10 8.28,-1.27; 11 11.049,-1.27; 12 13.792,-1.27; 13 16.561,-1.27; 14 -15.189,1.27; 15 -12.421,1.27; 16 -9.652,1.27; 17 -6.909,1.27; 18 -4.14,1.27; 19 -1.372,1.27; 20 1.372,1.27; 21 4.14,1.27; 22 6.909,1.27; 23 9.652,1.27; 24 12.421,1.27; 25 15.189,1.27 | drill 3.302 pad 5.08 round: G1 -23.52,0; G2 23.52,0
HEADER_SMD_2 = smd 5.08 x 1.524: 1 2.54,-1.27; 2 2.54,1.27
GPS15LF = hole 2.8: 33.274,-2.794; 33.249,-43.434; 2.921,-43.485
HEADER_SMD_6 = smd 5.08 x 1.524: 1 0,-6.35; 2 0,-3.81; 3 0,-1.27; 4 0,1.27; 5 0,3.81; 6 0,6.35
R0603 = smd 1 x 1.1: 1 -0.85,0; 2 0.85,0
R0805 = smd 1.3 x 1.5: 1 -0.95,0; 2 0.95,0
ML10 = drill 0.914 pad 1.676 square: 1 -5.08,-1.27 | drill 0.914 pad 1.676 round: 2 -5.08,1.27; 3 -2.54,-1.27; 4 -2.54,1.27; 5 0,-1.27; 6 0,1.27; 7 2.54,-1.27; 8 2.54,1.27; 9 5.08,-1.27; 10 5.08,1.27
SHIELD_38X50 = smd 7.366 x 2.032: P$1 2.54,0; P$2 35.306,0; P$3 35.56,50.8; P$4 2.794,50.8 | smd 2.032 x 5.334: P$5 0.127,47.117; P$6 -0.127,3.683; P$7 37.973,3.683; P$8 38.227,47.117
1X04 = drill 1.016 long: 1 -3.81,0; 2 -1.27,0; 3 1.27,0; 4 3.81,0
W237-102 = drill 1.194 long: 1 -2.5,-1.27; 2 2.5,-1.27
CRYSTAL_SMD = smd 5.486 x 1.981: 1 -4.75,0; 2 4.75,0

### Placement (x,y rotation side)
C1  93.01,27.79 90 bottom
C2  96.82,27.79 90 bottom
C3  85.9,27.79 90 bottom
C4  89.71,27.79 90 bottom
C5  79.04,27.79 90 bottom
C6  82.6,27.79 90 bottom
C7  72.19,27.79 90 bottom
C8  75.74,27.79 90 bottom
C9  81.8,47.33 90 bottom
C10  81.78,42.77 270 bottom
C11  102.74,49.43 0 bottom
C12  107.16,41.25 0 bottom
C13  87.88,42.65 270 bottom
C14  96.52,46.35 270 bottom
C15  93.37,61.77 180 bottom
C16  101.27,66.19 270 bottom
C17  77.47,63.07 0 bottom
C18  77.47,65.81 0 bottom
C19  78.49,57.63 0 bottom
C20  93.37,63.73 180 bottom
C21  136.88,46.76 180 bottom
C22  134.24,67.72 90 bottom
C23  123.16,45.72 180 bottom
C24  129.97,39.09 180 bottom
C25  126.21,63.68 270 bottom
C26  131.8,62.18 180 bottom
C27  129.84,43.43 180 bottom
C28  129.29,46.74 180 bottom
C29  119.25,61.34 270 bottom
C30  121.54,61.34 270 bottom
C31  120.45,69.06 0 bottom
C32  119.81,72.77 180 bottom
C33  119.15,41.53 180 bottom
C34  121.01,49.99 0 bottom
C35  24.38,22.16 270 top
C36  24.38,11.05 90 top
C37  33.53,27.75 90 top
C38  38.35,12.89 180 top
C39  33.53,19.94 270 top
C40  62.42,61.72 180 top
C41  62.42,52.58 180 top
C42  53.91,66.23 270 top
C43  62.42,43.43 180 top
C44  42.1,66.23 270 top
C45  103.76,32.18 90 top
C46  129.92,21.74 270 top
C47  131.6,15.65 90 top
C48  136.78,33.05 180 bottom
C49  118.31,33.32 90 top
C50  118.31,29.92 270 top
C51  53.53,31.75 90 top
C52  53.53,28.13 90 top
C53  58.29,34.67 0 top
C54  56.54,21.7 180 top
C55  62.04,34.67 0 top
C56  89.03,46.99 270 top
C57  89.53,57.05 90 top
C58  102.74,46.99 270 top
C59  102.95,56.46 90 top
C60  16.78,64.06 270 top
C61  107.19,49.43 0 bottom
C62  87.88,47.12 270 bottom
C63  136.73,30.89 180 bottom
C64  137.31,24.43 90 bottom
D1  26.15,36.25 180 bottom
D2  42.29,36.26 180 bottom
D3  44.2,51.5 0 bottom
D4  28.13,51.5 0 bottom
D5  14.92,51.5 180 top
D6  14.92,23.3 180 top
D7  129.29,69.19 90 bottom
F1  134.26,63.47 180 top
GAP1  26.07,40.14 0 top
GAP2  41.97,40.17 0 top
GAP3  41.91,57.09 0 top
GAP4  25.97,57.09 0 top
GAP5  11.28,14.48 0 top
GAP6  11.29,58.78 0 top
GPS_CONN  33.02,73.6 0 bottom
GPS_PPS  15.8,72.2 180 top
IC1  75.49,45.64 0 bottom
IC2  104.98,45.14 90 bottom
IC3  92.35,44.88 0 bottom
IC4  86.06,63.4 90 bottom
IC5  104.47,65.84 90 bottom
IC6  138.56,59.18 0 bottom
IC7  120.37,65.41 0 bottom
IC8  119.25,45.85 180 bottom
IC9  37.21,23.88 0 top
IC10  47.94,65.21 270 top
IC11  111.25,28.47 90 top
IC12  NC7SZ32  [SOT-23-5']  132.56,21.29 270 top
IC13  59.05,29.46 270 top
IC14  95.89,51.56 0 top
IC15  109.65,51.61 0 top
IC16  NC7SZ32  [SOT-23-5']  19.63,63.6 270 top
IC17  129.39,30.53 90 bottom
INPUT_CHANNEL  75.58,11.58 180 top
LOG  123.09,10.62 270 top
MODGPS1  56.9,28.89 180 top
PROG  111.28,8.08 270 top
R1  93.78,24.36 90 bottom
R2  93.01,20.8 90 bottom
R3  96.06,24.36 90 bottom
R4  96.82,20.8 90 bottom
R5  86.66,24.23 90 bottom
R6  85.9,20.8 90 bottom
R7  88.95,24.23 90 bottom
R8  89.71,20.8 90 bottom
R9  79.81,24.23 90 bottom
R10  79.04,20.68 90 bottom
R11  82.09,24.23 90 bottom
R12  82.85,20.68 90 bottom
R13  72.95,24.23 90 bottom
R14  72.19,20.65 90 bottom
R15  75.23,24.23 90 bottom
R16  76,20.65 90 bottom
R17  95.05,60.66 90 top
R18  93.09,60.66 90 top
R19  98.83,60.68 90 top
R20  96.77,60.68 90 top
R21  98.81,66.22 90 bottom
R22  109.09,59.69 270 top
R23  111.51,59.77 270 top
R24  107.44,59.69 270 top
R25  98.2,55.37 90 bottom
R26  100.41,55.37 90 bottom
R27  93.5,65.91 180 bottom
R28  126.67,24.41 180 top
R29  127.53,15.27 90 top
R30  129.06,15.27 270 top
R31  121.79,26.31 180 bottom
R32  121.77,28.3 180 bottom
R33  116.23,39.83 270 top
R34  106.32,39.8 90 top
R35  103.73,37.01 90 top
R36  93.22,42.55 270 top
R37  95,42.57 270 top
R38  96.75,42.57 270 top
R39  98.45,42.57 270 top
R40  121.82,14.27 270 top
R43  126.67,19.68 0 top
R44  26.04,42.67 0 bottom
R45  41.97,42.63 0 bottom
R47  25.97,59.75 0 bottom
R48  20.59,67.93 270 top
R51  5.46,52.01 180 top
R52  5.52,23.81 180 top
R53  66.83,27.3 0 top
R54  66.78,25.22 0 top
R55  66.83,29.31 0 top
R56  66.78,23.22 0 top
R57  101.73,32.13 270 top
RST  133.55,10.59 270 top
SERIAL_CONN  9.4,37.72 270 top
SHIELD1  62.48,35.69 90 bottom
USB_CONN  142.01,31.55 90 top
VIN  128.3,74.09 0 top
XTAL1  70.13,60.91 90 bottom
XTAL2  128.78,39.47 0 top

### Tracks (layer width: path | path; a pad name or v marks a point on that pad's centre or on a via)
1PPS_0
  Bottom 0.406: R47.2 25.02,57.79 24.32,57.09 GAP4.1 21.91,61.28 25.4,64.77 29.23,64.77 30.21,65.75 GPS_CONN.7
1PPS_1  (via drill 0.33 pad 0.41)
  Top 0.406: IC16.1 18.68,56.37 20.27,54.79 20.27,51.28 21.2,50.34 v23.77,50.34
  Bottom 0.406: D4.A1 27.56,54.48 | R47.1 26.92,55.88 27.88,54.93 D4.A1 | v23.77,50.34 26.72,50.34 27.88,51.5 D4.A1
+3V3  (via drill 0.3 pad 0.64, 0.33 pad 0.41)
  Top 0.406: IC13.16 61.22,34.64 C55.1 61.19,35.51 60.81,35.89 53.19,35.89 v50.42,33.12 | IC9.1 33.54,20.8 C39.1 32.47,20.79 30.86,19.18 30.86,14.61 32.58,12.89 C38.+ 35.79,13.32 v35.79,16.97 | 127.52,21.32 R43.2 127.53,19.67 R29.2 126.11,16.11 v126.11,16.13 | 127.52,21.32 128.79,22.59 C46.1 IC12.5 | 127.52,21.32 127.12,21.72 123.06,21.72 122.17,22.61 122.17,25.5 123.8,27.13 129.49,27.13 140.87,38.51 v140.87,38.56 | 102.74,51.05 125.07,51.05 v128.93,54.91 | 102.74,51.05 C58.1 103.62,47.84 104.45,47.01 IC15.1 | 102.74,51.05 90.91,51.05 89.03,49.17 C56.1 89.9,47.84 90.78,46.97 90.78,46.96 IC14.1
  Route2 0.406: v140.87,38.56 139.12,38.56 128.93,48.74 v128.93,54.91 | v126.11,16.13 126.11,13.84 116.28,4.01 43.94,4.01 35.79,12.17 v35.79,16.97 35.79,18.49 v50.42,33.12
+5V  (via drill 0.3 pad 0.64)
  Top 0.406: v98.78,70.16 115.82,70.16 119.96,66.01 v119.96,56.11
  Route2 0.406: v84.68,42.77 v84.68,54.43 84.68,67.16 87.68,70.16 v98.78,70.16
  Bottom 0.406: IC1.1 79.71,42.98 80.35,43.62 C10.1 83.83,43.62 v84.68,42.77 85.66,41.8 C13.2 87.9,41.81 IC3.4 | IC2.4 C11.2 101.89,51.01 106.99,56.11 v119.96,56.11 123.16,56.11 126.21,59.16 126.21,62.18 | IC6.12 C26.1 126.21,62.18 | 126.21,62.18 C25.+ 121.55,62.2 C30.1 | C30.1 121.54,62.2 | IC1.18 73.21,50.51 76.81,54.1 84.35,54.1 v84.68,54.43 | IC7.1 121.32,62.41 arc90 C30.1 | R21.2 98.78,67.07 v98.78,70.16 | C30.1 119.59,62.19 119.42,62.36 arc-90 C29.1 119.42,62.19 IC7.3
+5V/1  (via drill 0.3 pad 0.64, 0.33 pad 0.41)
  Top 0.406: IC9.8 33.58,26.95 C37.1 33.53,25.3 27.39,19.16 C35.+ | 51.05,67.08 IC10.8 53.87,67.12 C42.1 56.11,67.08 59.42,63.77 C40.+ 59.42,57.15 | v18.41,35.56 19.68,36.83 46.99,36.83 49.53,39.37 67.18,39.37 69.6,41.78 69.6,46.61 66.55,49.66 61.09,49.66 59.42,51.32 C41.+ 59.42,57.15 | C36.+ C35.+ | C35.+ 21.45,19.16 v20.19,17.91 | 59.42,57.15 69.47,57.15 71.63,59.31 71.63,68.33 76.2,72.9 118.92,72.9 128.35,63.48 F1.3 130.86,50.62 v136.09,45.39
  Route2 0.406: v18.41,35.56 18.41,19.68 v20.19,17.91
  Bottom 0.406: IC6.3 136.03,49.47 136.03,46.34 136.09,46.28 | C21.1 136.09,46.7 136.09,46.28 | v136.09,45.39 136.09,46.28
-5V  (via drill 0.3 pad 0.64)
  Route15 0.406: v109.04,39.4 118.29,39.4 v122.28,43.38
  Bottom 0.406: 128.44,49.44 IC6.9 128.44,49.48 C28.1 | C28.1 128.37,46.67 | C28.1 128.37,46.74 C27.- | IC1.27 79.06,47.76 80.34,46.48 C9.1 83.11,46.48 84.33,47.7 84.33,49.4 85.5,50.57 92.05,50.57 92.99,49.63 IC3.7 92.99,46.48 93.97,45.51 C14.2 96.52,44.27 99.54,41.25 C12.2 | C12.2 106.32,40.96 | C27.- C24.- 119.51,39.09 118.3,40.3 C33.1 IC8.5 | C12.2 106.31,40.22 107.16,39.37 109.04,39.37 v109.04,39.4 | IC2.7 106.88,44.5 106.31,43.93 C12.2 | v122.28,43.38 128.37,43.38 C27.-
AGND  (via drill 0.3 pad 0.64)
  Top 0.406: 103.01,57.38 C59.2 102.95,58.29 103.33,58.67 105.46,58.67 106.48,57.66 IC15.15 106.48,54.74 107.14,54.08 113.67,54.08 114.1,54.51 IC15.9 114.1,58.6 115.98,60.48 v117.86,60.48 | 100.31,56.16 IC14.9 100.33,54.66 99.67,54 93.34,54 92.71,54.63 IC14.15 92.71,57.48 92.29,57.9 C57.2 88.53,57.9 v87,59.44
  Bottom 0.305: IC1.12 72.56,40.89 71.93,40.26 | IC1.7 75.81,41.03 76.33,40.51 | 72.57,42.42 72.57,43.74 | 75.74,43.59 75.82,43.51 75.82,42.39 | 77.52,43.64 77.78,43.64 77.78,42.57 | 77.78,40.41 77.78,41.63 | IC1.26 78.41,48.29 78.13,48.01 | 78.18,50.85 78.41,50.85 78.41,49.78 | 71.32,50.83 71.27,50.83 71.27,49.78 | 70.81,48.01 71.27,48.46 71.27,48.77 | 76.45,50.62 76.45,49.84
  Bottom 0.406: 89.74,63.07 88.57,63.07 88.34,63.3 88.34,63.93 88.77,64.36 IC4.14 | 89.74,63.07 90.07,63.07 | 89.33,62.43 88.47,62.43 88.01,61.98 88.01,61.49 88.39,61.11 89.36,61.11 | IC4.14 | IC4.16 89.74,63.07 | 91.19,65.28 91.19,64.69 90.86,64.36 IC4.14 | C29.2 119.24,60.48 v117.86,60.48
  other vias: 77.5,23.5 84.51,23.5 91.36,23.5
  pour Route15 (isolate 0.305): 58.8,78.74 123.57,78.74 123.57,63.37 123.57,37.21 113.67,27.3 108.33,27.3 95,13.97 95,9.27 92.71,6.99 58.67,6.99 56.52,9.14 56.52,14.22 55.24,15.49 55.24,64.26 58.29,67.31 58.29,78.74 58.67,78.74
  pour Bottom (isolate 0.305): 0,78.79 148.59,78.79 148.59,0 0,0
AIN+
  Bottom 0.406: IC2.1 100.15,43.23 99.36,44.02 99.36,51.79 100.41,52.83 R26.1
AIN-  (via drill 0.3 pad 0.64)
  Route2 0.406: v96.83,52.65 100.08,49.4 v100.08,39.27
  Bottom 0.406: 98.15,54.47 R25.1 97.47,54.52 96.83,53.87 v96.83,52.65 | v100.08,39.27 100.08,39.32 95.3,39.32 94.26,40.36 IC3.1
AN1
  Bottom 0.406: R1.2 93.02,25.97 C1.1 92.16,26.94 91.69,27.41 91.69,29.95 87.35,34.29 76.96,34.29 75.16,36.09 IC1.8
AN2  (via drill 0.3 pad 0.64, 0.33 pad 0.41)
  Route15 0.406: v76.25,46.94 90.14,33.05 v91.44,33.05
  Bottom 0.406: R3.2 96.83,25.97 C2.1 96.23,26.94 95.45,27.71 95.45,29.03 v91.44,33.05 | v76.25,46.94 76.25,47.83 75.81,48.27 IC1.22
AN3
  Bottom 0.406: R5.2 85.9,25.84 C3.1 85.28,26.94 84.68,27.53 84.68,29.54 81.56,32.66 76.28,32.66 74.51,34.43 IC1.9
AN4  (via drill 0.3 pad 0.64, 0.33 pad 0.41)
  Route15 0.406: v75.39,47.52 75.39,42.19 v86.84,30.73
  Bottom 0.406: R7.2 89.71,25.84 C4.1 88.4,26.94 87.86,27.48 87.86,30.23 87.35,30.73 v86.84,30.73 | IC1.21 75.16,47.75 v75.39,47.52
AN5
  Bottom 0.406: R9.2 79.05,25.84 C5.1 78.3,26.94 77.88,27.36 77.88,29.52 73.86,33.53 IC1.10
AN6  (via drill 0.3 pad 0.64, 0.33 pad 0.41)
  Route15 0.406: v74.52,46.97 74.52,36.66 v80.45,30.73
  Bottom 0.406: IC1.20 v74.51,46.97 v74.52,46.97 | R11.2 82.09,25.7 82.6,26.21 C6.1 81.6,26.94 81.18,27.36 81.18,30.01 v80.45,30.73
AN7
  Bottom 0.406: R13.2 72.19,25.84 C7.1 71.16,26.94 69.93,28.17 69.93,30.84 73.21,34.12 IC1.11
AN8  (via drill 0.3 pad 0.64)
  Route15 0.406: v73.53,47.55 73.53,30.81 arc90 v73.61,30.73
  Bottom 0.406: IC1.19 73.86,47.88 v73.53,47.55 | R15.2 75.23,25.7 75.74,26.21 C8.1 74.71,26.94 74.12,27.53 74.12,30.23 v73.61,30.73
CHANNEL1
  Bottom 0.406: R1.1 93.02,22.75 R2.2 93.84,21.65 94.49,21.01 94.49,18.47 90.77,14.74 INPUT_CHANNEL.14
CHANNEL2
  Bottom 0.406: R3.1 96.83,22.75 R4.2 96.02,21.65 95.4,21.03 95.4,16.89 92.14,13.62 INPUT_CHANNEL.1
CHANNEL3
  Bottom 0.406: R5.1 85.9,22.62 R6.2 86.58,21.65 87.33,20.9 87.33,17.73 88,17.06 INPUT_CHANNEL.15
CHANNEL4
  Bottom 0.406: R7.1 89.71,22.62 R8.2 89.1,21.65 88.38,20.93 88.38,18.17 89.37,17.18 INPUT_CHANNEL.2
CHANNEL5
  Bottom 0.406: R9.1 79.05,22.62 R10.2 79.78,21.53 80.52,20.79 80.52,18.49 85.23,13.78 INPUT_CHANNEL.16
CHANNEL6
  Bottom 0.406: R11.1 82.86,22.62 R12.2 82.05,21.53 81.52,20.99 81.52,19.09 86.62,13.98 INPUT_CHANNEL.3
CHANNEL7
  Bottom 0.406: R13.1 72.19,22.62 R14.2 72.94,21.5 73.52,20.92 73.52,18.26 77.05,14.73 81.28,14.73 82.48,13.53 INPUT_CHANNEL.17
CHANNEL8
  Bottom 0.406: R15.1 76,22.62 R16.2 75.14,21.5 74.65,21.01 74.65,18.67 77.44,15.88 81.76,15.88 83.86,13.78 INPUT_CHANNEL.4
DGND  (via drill 0.3 pad 0.64, 0.33 pad 0.41, 0.6, 0.6 pad 1.68)
  Top 0.406: IC11.8 117.2,29.74 117.87,29.07 C50.2 | v137.16,66.04 135.13,66.04 134.26,65.18 F1.2
  Bottom 0.406: v21.64,53.42 23.81,53.42 D4.A2 | v37.97,53.39 39.74,53.39 D3.A2 | GPS_CONN.2 35.21,73.5 v34.54,74.17 | C48.2 137.58,32.99 C63.2 139.22,30.89 139.83,30.28 USB_CONN.2 | D2.A1 39.98,38.53 v41.5,40.06 | 130.42,27.61 130.42,25.72 133.19,22.96 C64.- 139.99,22.96 v142.02,24.99 v142.02,25 | 130.42,28.26 130.42,30.86 | IC17.18 131.21,32.81 130.42,32.02 130.42,30.86 | 130.42,27.61 IC17.26 | 130.42,28.26 IC17.25 | 130.42,27.61 130.42,28.26 | 130.42,30.86 IC17.21 | IC17.7 123.04,30.21 v122.58,29.74 | IC6.1 138.56,48.13 138.22,47.79 138.04,47.79 137.73,47.48 C21.2 v140.28,46.76 v140.29,46.76 | D1.A1 23.86,38.29 v25.63,40.06 | VIN.1 125.8,70.32 126.92,69.19 D7.A 127.79,68.17 129.72,66.24 C22.- 137.16,66.24 v137.16,66.04
  pour Route2 (isolate 0.305): 17.65,78.74 49.91,78.74 49.91,67.94 53.59,64.26 53.59,19.56 46.48,12.45 46.48,9.14 50.04,5.59 113.28,5.59 125.22,17.53 125.22,68.96 140.97,68.96 148.59,61.34 148.59,16.76 131.83,0 16.89,0 0,16.89 0,61.09
  pour Top (isolate 0.305): 0,78.79 148.59,78.79 148.59,0 0,0
HW_RX  (via drill 0.3 pad 0.64)
  Top 0.406: IC11.18 106.32,33.53 109.04,33.53 v110.06,32.51 111.19,31.38 111.19,19.81 109.67,18.29 103.5,18.29 92.69,29.11 67.88,29.11 R55.2
  Route2 0.406: v110.06,32.51 116.26,26.31 v119.46,26.31
  Bottom 0.406: v119.46,26.31 R31.1
HW_TX  (via drill 0.3 pad 0.64)
  Top 0.406: IC11.17 110.36,34.82 v112.7,32.49 112.71,32.47 112.71,19.75 110.3,17.34 103.12,17.34 93.15,27.3 R53.2
  Route2 0.406: v112.7,32.49 115.47,29.72 v120.9,29.72
  Bottom 0.406: v120.9,29.72 120.92,29.7 R32.1
N$1  (via drill 0.3 pad 0.64)
  Top 0.406: 98.87,61.49 R19.2 | 98.87,61.49 98.89,61.47 | v100.58,61.49 98.87,61.49
  Route15 0.406: v105.26,44.81 103.1,46.97 103.1,59.46 101.07,61.49 v100.58,61.49
  Bottom 0.406: IC2.6 106.22,45.77 v105.26,44.81
N$2  (via drill 0.3 pad 0.64)
  Top 0.406: v96.77,62.59 R20.2
  Route15 0.406: v90.25,44.5 91.52,45.77 91.52,57.33 v96.77,62.59
  Bottom 0.406: IC3.6 91.72,45.97 v90.25,44.5
N$3  (via drill 0.3 pad 0.64)
  Top 0.406: v72.57,45.72 72.57,50.88 83.2,61.51 R18.2
  Bottom 0.406: v72.57,45.72 v72.56,45.72 IC1.17
N$4  (via drill 0.3 pad 0.64)
  Top 0.406: v71.53,47.19 71.53,52.22 82.04,62.74 94.74,62.74 95.05,62.43 R17.2
  Bottom 0.406: v71.53,47.19 71.91,47.58 IC1.16
N$5
  Bottom 0.406: IC4.18 C15.1 92.52,60.74 93.12,60.15 97.46,60.15 98.81,61.49 R21.1 101.27,65.37 C16.+ 101.27,64.89 IC5.1
N$6
  Bottom 0.406: XTAL1.1 67.74,56.16 66.34,57.56 66.34,68.94 67.84,70.43 80.54,70.43 82.43,68.55 IC4.10
N$7  (via drill 0.3 pad 0.64)
  Top 0.406: v109.09,62.13 R22.1
  Route15 0.406: v87.5,64.36 89.18,66.04 105.18,66.04 v109.09,62.13
  Bottom 0.406: IC4.13 88.16,65.02 v87.5,64.36
N$8  (via drill 0.3 pad 0.64)
  Top 0.406: R23.1 111.51,65.43 v109.6,67.33
  Route2 0.406: v87.25,66.45 108.71,66.45 v109.6,67.33
  Bottom 0.406: IC4.12 88.02,65.67 v87.25,66.45
N$9  (via drill 0.3 pad 0.64)
  Top 0.406: v107.44,68.28 R24.1
  Route2 0.406: v89.69,68.22 107.44,68.22 v107.44,68.28
  Bottom 0.406: IC4.11 89.68,67.71 v89.69,68.22
N$10
  Bottom 0.406: XTAL1.2 72.49,65.66 75.18,68.35 79.55,68.35 80.52,67.39 80.52,65.99 80.83,65.67 IC4.9
N$11
  Top 0.406: C52.2 53.55,28.96 IC13.4
N$12
  Top 0.406: R29.1 R30.2 129.06,12.39 129.87,11.58 131.55,11.58 132.28,10.85 RST.1
N$13
  Bottom 0.406: IC4.3 80.95,61.77 79.34,60.16 C19.1
N$14
  Bottom 0.406: IC4.4 80.18,62.42 77.64,59.88 C19.2
N$15
  Bottom 0.406: IC4.2 81.44,61.12 80.8,60.48 80.8,58.83 83.4,56.22 R25.2
N$16
  Bottom 0.406: R26.2 100.41,56.9 99.47,57.84 83.97,57.84 82.43,59.38 IC4.1
N$17
  Top 0.406: IC12.4 133.51,23.33 132.44,24.41 R28.1
N$18  (via drill 3.68 pad 7.11)
  other vias: 5.08,73.66
N$19
  Top 0.406: XTAL2.1 124.03,35.66 121.31,32.94 120.94,32.58 120.84,32.48 C49.1 117.72,32.48 117.53,32.28 IC11.10
N$20
  Top 0.406: R30.1 129.06,16.79 129.67,17.4 131.32,17.4 C47.+ 131.6,19.97 IC12.1
N$21
  Bottom 0.406: C48.1 135.1,33.05 134.69,33.46 IC17.17 129.9,33.46 128.68,32.23 128.68,29.23 127.7,28.26 IC17.4
N$22
  Top 0.406: XTAL2.2 133.53,38.66 125.87,31 125.74,30.87 125.64,30.77 C50.1 117.77,30.77 117.53,31.01 IC11.9
N$23
  Bottom 0.406: IC17.1 122.65,26.31 R31.2
N$24
  Top 0.406: IC11.16 106.23,36.16 R35.1
N$25
  Top 0.406: R34.1 106.29,38.92 IC11.15
N$26
  Top 0.406: R33.2 116.21,38.96 IC11.14
N$27
  Top 0.406: IC11.26 101.58,23.39 93.22,31.75 R36.2
N$28
  Top 0.406: IC11.25 101.83,24.66 95,31.5 R37.2
N$29
  Top 0.406: IC11.24 102.34,25.93 96.75,31.52 R38.2
N$30
  Top 0.406: IC11.23 103.1,27.2 98.45,31.85 R39.2
N$31
  Top 0.406: R40.1 121.82,20.17 117.32,24.66 IC11.4
N$32
  Bottom 0.406: IC17.5 124.08,28.91 123.47,28.3 R32.2
N$33
  Bottom 0.406: IC17.20 134.61,31.51 135.23,30.89 C63.1 135.88,28.97 136.78,28.07 137.11,27.74 | C64.+ 137.31,27.53 137.11,27.74 | 137.11,27.74 USB_CONN.1
N$34
  Top 0.406: C51.2 53.7,32.77 IC13.1
N$35
  Top 0.406: C51.1 53.87,30.9 54.55,30.23 IC13.3
N$36
  Top 0.406: C52.1 54.2,27.28 54.61,27.69 IC13.5
N$37
  Top 0.406: IC13.11 63.8,26.42 64.69,27.3 R53.1
N$38
  Top 0.406: IC13.2 57.58,31.5 58.06,31.98 58.06,33.78 57.44,34.4 C53.1
N$39
  Top 0.406: IC13.6 57.26,26.42 57.86,25.82 57.86,22.9 57.38,22.43 C54.1
N$40
  Top 0.406: IC16.4 R48.2
N$41
  Top 0.406: R48.1 18.29,68.78 17.07,70 GPS_PPS.1
N$42
  Top 0.406: IC13.10 65.93,25.15 R54.1
N$43  (via drill 3.68 pad 7.11)
  other vias: 5.08,5.08
N$44
  Top 0.406: IC13.12 63.6,27.69 64.31,28.4 64.31,28.96 64.67,29.31 R55.1
N$45
  Top 0.406: IC13.9 64.21,23.88 64.87,23.22 R56.1
N$46
  Top 0.406: R57.2 101.73,30.61 102.59,29.74 IC11.21
N$49  (via drill 3.68 pad 7.11)
  other vias: 143.51,5.08
N$50  (via drill 3.68 pad 7.11)
  other vias: 143.51,73.66
N$52  (via drill 0.6 pad 1.68)
  Top 0.406: v141.1,63.45 137.69,63.45 F1.1
  Bottom 0.406: VIN.2 130.79,72.81 D7.K C22.+ 137.69,69.19 141.1,65.79 v141.1,63.45
OUTA  (via drill 0.3 pad 0.64)
  Route15 0.406: v95.96,49.68 97.77,49.68 v104.32,43.13
  Bottom 0.406: IC2.2 101.93,44.53 102.92,44.53 v104.32,43.13 | IC1.28 79.71,51.04 80.9,52.22 93.42,52.22 v95.96,49.68
OUTB
  Bottom 0.406: IC1.2 79.06,39.78 79.96,38.89 92.2,38.89 92.99,39.67 IC3.2
PGC  (via drill 0.33 pad 0.41)
  Top 0.406: v103.76,21.97 103.91,22.12 IC11.27 | PROG.3 109.98,8.1 v109.98,13.08
  Route2 0.406: v103.76,21.97 104.9,21.97 109.98,16.89 v109.98,13.08
PGD  (via drill 0.33 pad 0.41)
  Top 0.406: IC11.28 104.67,20.85 v104.14,20.32 | PROG.2 107.44,8.1 v107.44,13.08
  Route2 0.406: v104.14,20.32 104.14,16.38 v107.44,13.08
PIN0_A0
  Top 0.406: IC14.14 93.98,58.32 93.75,58.55 93.37,58.55 93.09,58.83 R18.1
PIN0_A1
  Top 0.406: IC14.13 95.25,58.7 95.05,58.9 R17.1
PIN0_SCL
  Top 0.406: IC15.14 107.75,57.86 107.44,58.17 R24.2
PIN0_SDI
  Top 0.406: IC15.13 109.02,57.84 109.09,57.91 R22.2
PIN0_SDO
  Top 0.406: IC15.11 111.51,56.26 R23.2
PIN0_SWA
  Top 0.406: IC14.11 97.79,58.4 97.92,58.52 98.58,58.52 98.83,58.78 R19.1
PIN0_SWB
  Top 0.406: IC14.12 96.52,58.55 96.77,58.8 R20.1
PIN_A0
  Top 0.406: IC14.3 93.98,45.03 93.22,44.27 R36.1
PIN_A1
  Top 0.406: IC14.4 95.25,44.91 95,44.65 R37.1
PIN_IO1
  Top 0.406: LOG.1 R40.2
PIN_SCL
  Top 0.406: IC15.3 107.75,48.39 108.86,49.51 114.86,49.51 116.23,48.13 R33.1
PIN_SDI
  Top 0.406: R35.2 103.73,40.77 105,42.04 107.82,42.04 109.02,43.23 IC15.4 108.99,46.99
PIN_SDO
  Top 0.406: R34.2 108.09,40.65 111.56,44.12 IC15.6
PIN_SWA
  Top 0.406: IC14.6 97.79,44.93 98.45,44.27 R39.1
PIN_SWB
  Top 0.406: IC14.5 96.52,44.88 96.75,44.65 R38.1
RXCOM_0
  Top 0.406: GAP6.1 6.58,58.78 4.51,56.71 R51.2 4.51,47.56 6.1,45.97 9.53,45.97 10.67,44.83 SERIAL_CONN.2
RXCOM_1
  Top 0.406: IC13.14 63.5,30.23 65.15,31.88 65.15,35.31 62.87,37.59 51.56,37.59 49.28,35.31 21.59,35.31 19.3,33.02 17.93,33.02 13.14,37.81 D5.A2 R51.1
RXGPS_0
  Bottom 0.406: GPS_CONN.5 32.21,52.78 27.43,48.01 24.13,48.01 22,45.88 GAP1.1 23.75,40.13 25.09,41.47 R44.2
RXGPS_1  (via drill 0.33 pad 0.41)
  Top 0.406: IC13.7 50.16,25.15 47.62,27.69 47.62,31.37 45.21,33.78 29.41,33.78 v27.79,32.16
  Bottom 0.406: R44.1 26.98,39.49 27.93,38.54 D1.A2 27.81,36.89 27.79,36.89 v27.79,32.16
SW_RX  (via drill 0.33 pad 0.41)
  Top 0.406: v117.73,22.1 116.23,22.1 IC11.2 115.34,22.12 114.55,21.34 114.55,18.92 111,15.37 102.23,15.37 96.14,21.46 68.45,21.46 67.56,22.35 67.56,23.22 R56.2 | R57.1 101.66,33.05 v100.33,33.05
  Route2 0.406: v100.33,33.05 106.78,33.05 v117.73,22.1
SW_TX
  Top 0.406: IC11.3 114.83,23.39 113.67,22.23 113.67,19.3 110.74,16.38 102.62,16.38 93.78,25.22 R54.2
TXCOM_0
  Top 0.406: GAP5.1 4.57,17.12 R52.2 4.57,39.37 5.46,40.26 SERIAL_CONN.3
TXCOM_1
  Top 0.406: R52.1 D6.A2 13.03,23.93 13.03,25.93 15.42,28.32 28.57,28.32 30.99,30.73 39.83,30.73 41.91,28.65 41.91,26.04 48.01,19.94 58.57,19.94 59.31,20.69 59.31,28.2 60.07,28.96 IC13.13
TXGPS_0
  Bottom 0.406: GPS_CONN.4 33.21,44.77 GAP2.1 39.69,40.17 41.02,41.51 R45.2
TXGPS_1  (via drill 0.33 pad 0.41)
  Top 0.406: IC13.8 47.75,23.88 44.07,27.56 v44.07,32.13
  Bottom 0.406: R45.1 42.92,39.55 44.04,38.43 D2.A2 | D2.A2 44.07,36.99 | v44.07,32.13 D2.A2
USBDM
  Bottom 0.406: IC17.16 134.87,34.11 135.2,34.44 138.81,34.44 140.44,32.82 USB_CONN.3
USBDP
  Bottom 0.406: IC17.15 134.22,34.76 134.87,35.41 141.96,35.41 USB_CONN.4
V+  (via drill 0.3 pad 0.64)
  Top 0.406: 102.99,55.65 C59.1 | 91.49,56.11 IC14.16 89.57,56.16 | 89.57,56.16 C57.1 | 105.21,55.65 IC15.16 | C59.1 102.92,55.59 | C57.1 89.51,56.17 | 89.57,56.16 89.51,56.1 v89.51,54.18 | 105.21,55.65 105.23,55.65 | 102.99,55.65 101.88,55.65 101.45,56.08 v101.45,58.75 | 102.99,55.65 105.21,55.65 | 102.99,55.65 arc90 C59.1 | v81.05,56.13 89.47,56.13 C57.1
  Route2 0.406: v89.51,54.18 94.08,58.75 v101.45,58.75 106.5,53.7 v106.5,52.63
  Route15 0.406: v121.41,74.78 119.91,73.28 97.54,73.28 94.23,69.98 v85.09,69.98 80.49,69.98 75.82,65.3 75.82,63.5 v77.65,61.67 77.65,57.35 78.87,56.13 v81.05,56.13 | v86.41,47.95 86.41,51.08 v89.51,54.18
  Bottom 0.406: IC2.5 108.04,47.04 C61.1 108.04,51.3 106.7,52.63 v106.5,52.63 | IC4.5 C17.1 78.32,62.34 v77.65,61.67 | C32.+ 121.12,72.76 | C32.+ C31.1 121.32,69.04 IC7.5 | v86.41,47.95 86.42,47.97 C62.1 87.9,47.95 IC3.5 | C32.+ 121.41,72.9 v121.41,74.78 | v85.09,69.98 85.45,70.33 92.73,70.33 94.45,68.62 R27.2
V-  (via drill 0.3 pad 0.64)
  Route15 0.406: v78.36,64.54 81.36,61.54 89.99,61.54 92.76,64.31 102.31,64.31 113.97,52.65 v121.72,52.65
  Bottom 0.406: IC4.6 81.21,63.72 79.12,65.81 C18.1 78.36,65.77 v78.36,64.54 | v121.72,52.65 122.48,51.89 C34.- 122.31,49.82 C23.1 121.28,45.72 121.03,45.47 121.03,44.83 120.75,44.55 IC8.4
VDIG
  Bottom 0.406: IC4.15 C20.1 92.55,63.76 R27.1
VGPS_1  (via drill 0.33 pad 0.41, 0.6)
  Top 0.406: v38.1,64.9 40.28,67.08 C44.1 42.1,67.12 IC10.1 46.55,67.12 48.64,65.02 48.64,53.47 45.47,50.29 v43.94,50.29 43.94,49.4 49.91,43.43 C43.+ | v15.01,64.9 15.02,64.91 C60.1 IC16.5
  Route2 0.406: v43.94,50.29 41.4,48.26 14.91,48.26 11.46,51.71 11.46,62.61 13.74,64.9 v15.01,64.9
  Bottom 0.406: v43.94,50.29 D3.A1 43.81,53.66 43.81,54.99 41.72,57.09 GAP3.1 | v38.1,64.9 35.18,64.9 34.21,65.87 GPS_CONN.3
VPIC  (via drill 0.3 pad 0.64, 0.33 pad 0.41)
  Top 0.406: C45.1 104.08,31.01 IC11.20 108.56,31.01 109.47,30.1 v109.47,24.89 | PROG.4 112.65,8.18 v112.65,13.08 | v123.7,19.68 R43.1
  Route2 0.406: v123.7,19.68 117.09,13.08 v112.65,13.08 112.65,21.72 v109.47,24.89
VPP  (via drill 0.3 pad 0.64, 0.33 pad 0.41)
  Top 0.406: IC11.1 | 115.32,8.36 PROG.5 115.19,8.18 115.19,13.21 116.21,14.23 IC11.1 | IC11.1 118.52,20.85 v119.1,20.27 | v124.21,24.41 R28.2
  Route2 0.406: v119.1,20.27 123.24,24.41 v124.21,24.41

### Text on the board
tPlace: +5V | D+ | D- | GND | VCC | RVRQ-AUG19